# EAGLE design aloysius_B_v1 (EAGLE 9.6.2)

## Sheet 1 of 3: Power
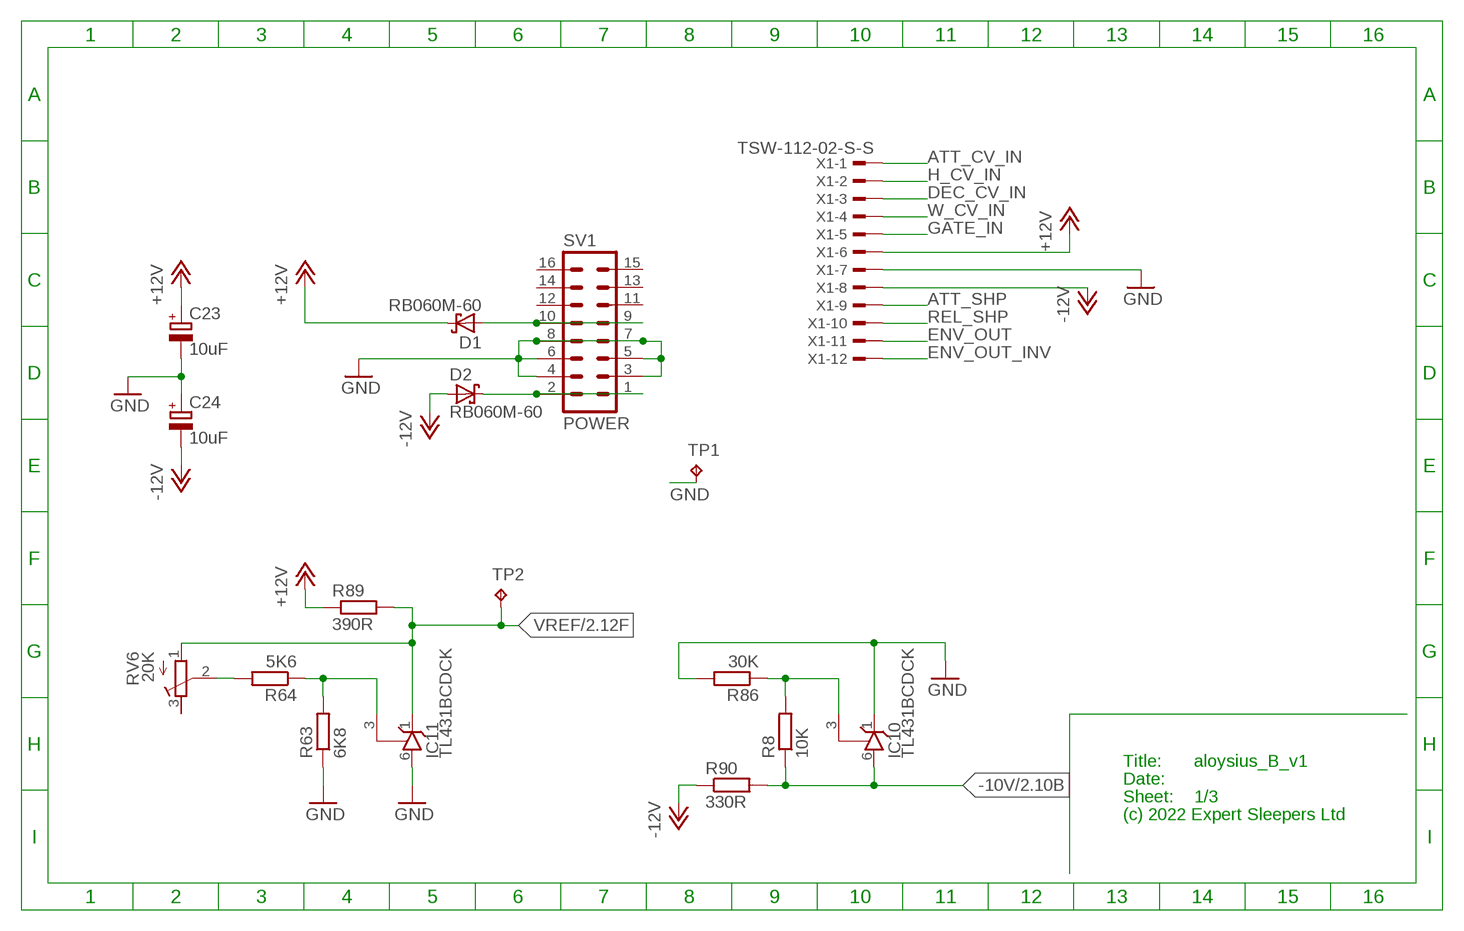
[diagram p0: schematic, sheet 1]

### Parts
C23  10uF  CPOL-EUUD-4X5,8  [UD-4X5,8_NICHICON]
C24  10uF  CPOL-EUUD-4X5,8  [UD-4X5,8_NICHICON]
D1  RB060M-60  [SOD123FL]
D2  RB060M-60  [SOD123FL]
IC10  TL431BCDCK  [DCK_SC-70]
IC11  TL431BCDCK  [DCK_SC-70]
R8  10K  R-EU_R0603  [R0603]
R63  6K8  R-EU_R0603  [R0603]
R64  5K6  R-EU_R0603  [R0603]
R86  30K  R-EU_R0603  [R0603]
R89  390R  R-EU_R1206  [R1206]
R90  330R  R-EU_R1206  [R1206]
RV6  20K  TC33X  [TC33X]
SV1  POWER  ML16  [ML16]
TP1  RA2  TPPAD1-13  [P1-13]
TP2  RA2  TPPAD1-13  [P1-13]
X1  TSW-112-02-S-S  [TSW-112-02-S-S]

### Nets
+12V: C23.+ D1.C R89.1 X1.6 ; also sheet 2,3
-10V [power]: IC10.6(A) R8.1 R90.2 ; also sheet 2
-12V: C24.- D2.A R90.1 X1.8 ; also sheet 2
ATT_CV_IN: X1.1 ; also sheet 2
ATT_SHP: X1.9 ; also sheet 2
DEC_CV_IN: X1.3 ; also sheet 2
ENV_OUT: X1.11 ; also sheet 2
ENV_OUT_INV: X1.12 ; also sheet 2
GATE_IN: X1.5 ; also sheet 3
GND [power]: C23.- C24.+ IC10.1(C) IC11.6(A) R63.1 R86.2 SV1.3 SV1.4 SV1.5 SV1.6 SV1.7 SV1.8 TP1.TP X1.7 ; also sheet 2,3
H_CV_IN: X1.2 ; also sheet 2
N$1: D2.C SV1.1 SV1.2
N$15: D1.A SV1.9 SV1.10
N$20: IC11.3(R) R63.2 R64.1
N$21: R64.2 RV6.2(S)
N$28 [power]: IC10.3(R) R8.2 R86.1
REL_SHP: X1.10 ; also sheet 2
VREF: IC11.1(C) R89.2 RV6.1(A) TP2.TP ; also sheet 2
W_CV_IN: X1.4 ; also sheet 2
Unconnected: RV6.3(E) SV1.11 SV1.12 SV1.13 SV1.14 SV1.15 SV1.16

### Notes on the sheet
- Title:
- Date:
- Sheet:
- (c) 2022 Expert Sleepers Ltd

## Sheet 2 of 3: CV processing and integrator
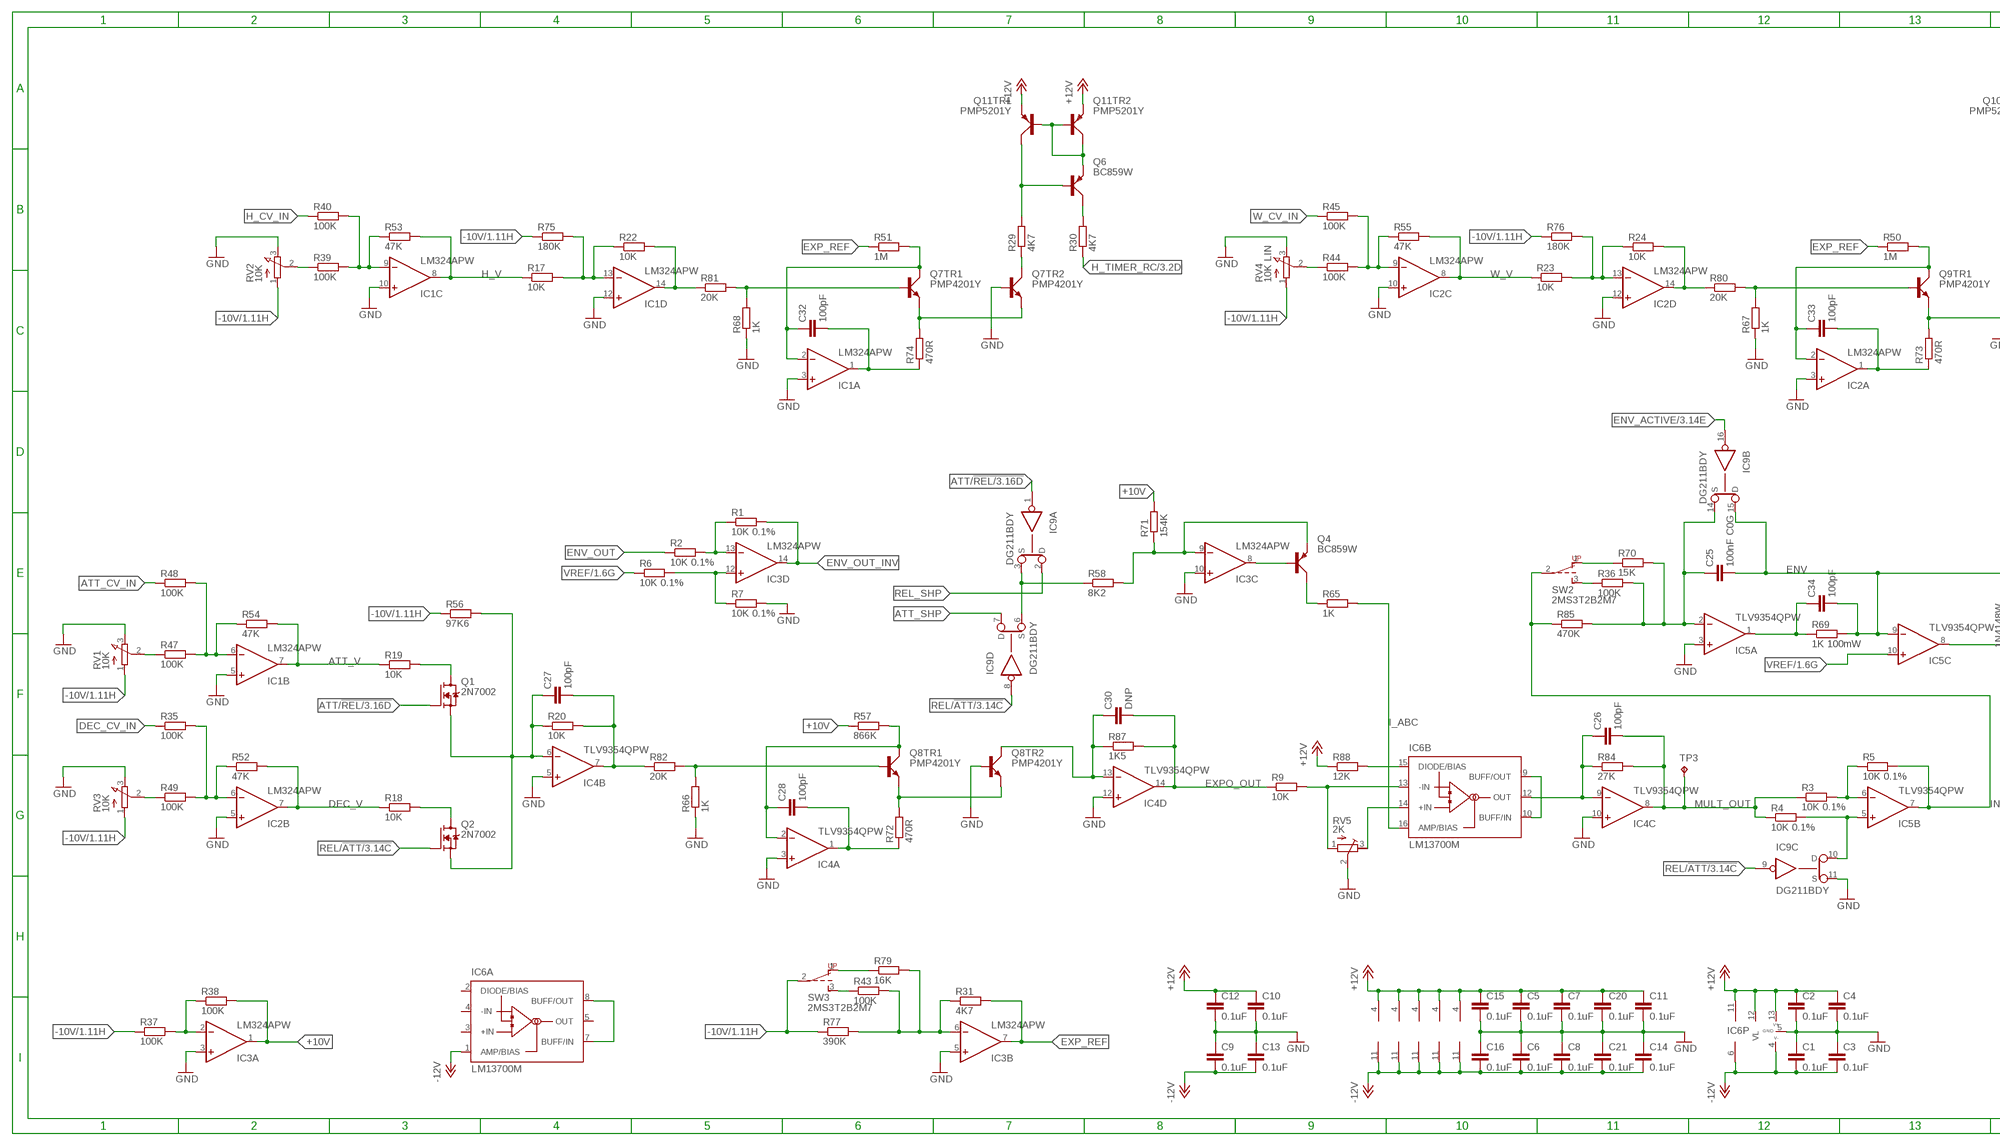
[diagram p1: schematic, sheet 2, part 1 of 2]
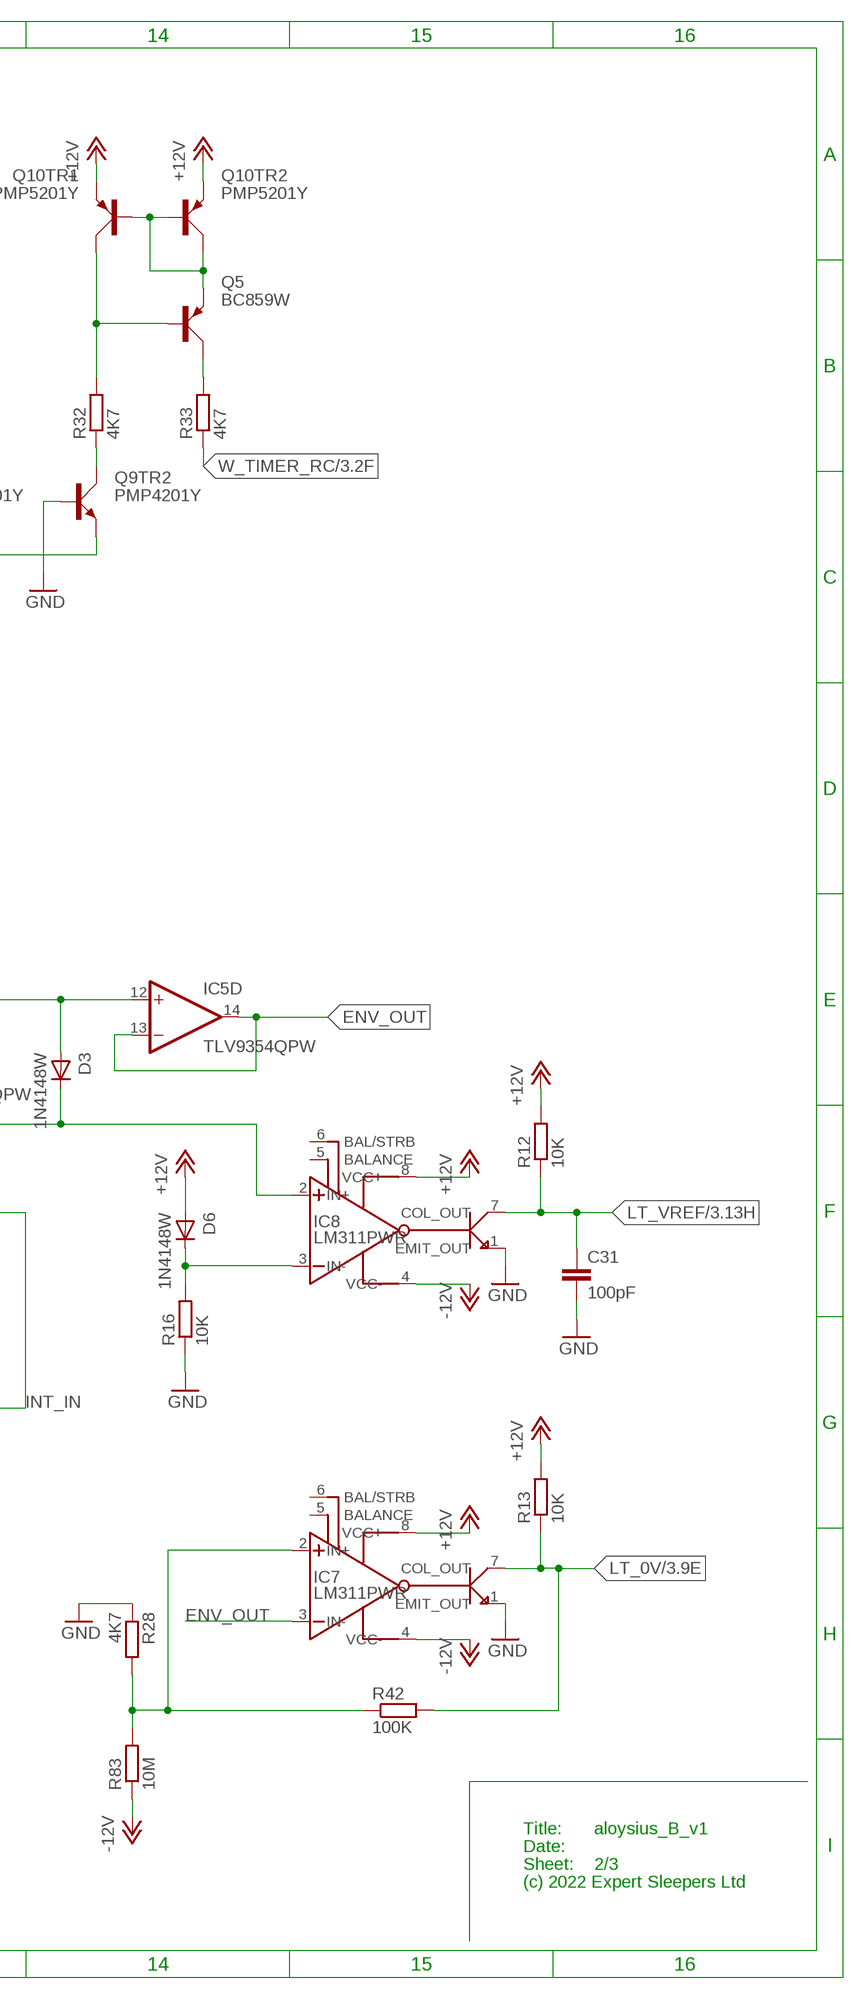
[diagram p2: schematic, sheet 2, part 2 of 2]

### Parts
C1  0.1uF  C-EUC0402  [C0402]
C2  0.1uF  C-EUC0402  [C0402]
C3  0.1uF  C-EUC0402  [C0402]
C4  0.1uF  C-EUC0402  [C0402]
C5  0.1uF  C-EUC0402  [C0402]
C6  0.1uF  C-EUC0402  [C0402]
C7  0.1uF  C-EUC0402  [C0402]
C8  0.1uF  C-EUC0402  [C0402]
C9  0.1uF  C-EUC0402  [C0402]
C10  0.1uF  C-EUC0402  [C0402]
C11  0.1uF  C-EUC0402  [C0402]
C12  0.1uF  C-EUC0402  [C0402]
C13  0.1uF  C-EUC0402  [C0402]
C14  0.1uF  C-EUC0402  [C0402]
C15  0.1uF  C-EUC0402  [C0402]
C16  0.1uF  C-EUC0402  [C0402]
C20  0.1uF  C-EUC0402  [C0402]
C21  0.1uF  C-EUC0402  [C0402]
C25  100nF C0G  C-EUC1206  [C1206]
C26  100pF  C-EUC0603  [C0603]
C27  100pF  C-EUC0603  [C0603]
C28  100pF  C-EUC0603  [C0603]
C30  DNP  C-EUC0603  [C0603]
C31  100pF  C-EUC0603  [C0603]
C32  100pF  C-EUC0603  [C0603]
C33  100pF  C-EUC0603  [C0603]
C34  100pF  C-EUC0603  [C0603]
D3  1N4148W  [SOD123]
D6  1N4148W  [SOD123]
IC1  LM324APW  TL074PW  [PW_R-PDSO-G14]
IC2  LM324APW  TL074PW  [PW_R-PDSO-G14]
IC3  LM324APW  TL074PW  [PW_R-PDSO-G14]
IC4  TLV9354QPW  TL074PW  [PW_R-PDSO-G14]
IC5  TLV9354QPW  TL074PW  [PW_R-PDSO-G14]
IC6  LM13700M  [SO16]
IC7  LM311PWR  [SOP65P640X120-8N]
IC8  LM311PWR  [SOP65P640X120-8N]
IC9  DG211BDY  DG211CJD  [SO16]
Q1  2N7002  [SOT23]
Q2  2N7002  [SOT23]
Q4  BC859W  [SOT323]
Q5  BC859W  [SOT323]
Q6  BC859W  [SOT323]
Q7  PMP4201Y  [SOT65P210X110-6N]
Q8  PMP4201Y  [SOT65P210X110-6N]
Q9  PMP4201Y  [SOT65P210X110-6N]
Q10  PMP5201Y  [SOT65P210X110-6N]
Q11  PMP5201Y  [SOT65P210X110-6N]
R1  10K 0.1%  R-EU_R0603  [R0603]
R2  10K 0.1%  R-EU_R0603  [R0603]
R3  10K 0.1%  R-EU_R0603  [R0603]
R4  10K 0.1%  R-EU_R0603  [R0603]
R5  10K 0.1%  R-EU_R0603  [R0603]
R6  10K 0.1%  R-EU_R0603  [R0603]
R7  10K 0.1%  R-EU_R0603  [R0603]
R9  10K  R-EU_R0603  [R0603]
R12  10K  R-EU_R0603  [R0603]
R13  10K  R-EU_R0603  [R0603]
R16  10K  R-EU_R0603  [R0603]
R17  10K  R-EU_R0603  [R0603]
R18  10K  R-EU_R0603  [R0603]
R19  10K  R-EU_R0603  [R0603]
R20  10K  R-EU_R0603  [R0603]
R22  10K  R-EU_R0603  [R0603]
R23  10K  R-EU_R0603  [R0603]
R24  10K  R-EU_R0603  [R0603]
R28  4K7  R-EU_R0603  [R0603]
R29  4K7  R-EU_R0603  [R0603]
R30  4K7  R-EU_R0603  [R0603]
R31  4K7  R-EU_R0603  [R0603]
R32  4K7  R-EU_R0603  [R0603]
R33  4K7  R-EU_R0603  [R0603]
R35  100K  R-EU_R0603  [R0603]
R36  100K  R-EU_R0603  [R0603]
R37  100K  R-EU_R0603  [R0603]
R38  100K  R-EU_R0603  [R0603]
R39  100K  R-EU_R0603  [R0603]
R40  100K  R-EU_R0603  [R0603]
R42  100K  R-EU_R0603  [R0603]
R43  100K  R-EU_R0603  [R0603]
R44  100K  R-EU_R0603  [R0603]
R45  100K  R-EU_R0603  [R0603]
R47  100K  R-EU_R0603  [R0603]
R48  100K  R-EU_R0603  [R0603]
R49  100K  R-EU_R0603  [R0603]
R50  1M  R-EU_R0603  [R0603]
R51  1M  R-EU_R0603  [R0603]
R52  47K  R-EU_R0603  [R0603]
R53  47K  R-EU_R0603  [R0603]
R54  47K  R-EU_R0603  [R0603]
R55  47K  R-EU_R0603  [R0603]
R56  97K6  R-EU_R0603  [R0603]
R57  866K  R-EU_R0603  [R0603]
R58  8K2  R-EU_R0603  [R0603]
R65  1K  R-EU_R0603  [R0603]
R66  1K  R-EU_R0603  [R0603]
R67  1K  R-EU_R0603  [R0603]
R68  1K  R-EU_R0603  [R0603]
R69  1K 100mW  R-EU_R0603  [R0603]
R70  15K  R-EU_R0603  [R0603]
R71  154K  R-EU_R0603  [R0603]
R72  470R  R-EU_R0603  [R0603]
R73  470R  R-EU_R0603  [R0603]
R74  470R  R-EU_R0603  [R0603]
R75  180K  R-EU_R0603  [R0603]
R76  180K  R-EU_R0603  [R0603]
R77  390K  R-EU_R0603  [R0603]
R79  16K  R-EU_R0603  [R0603]
R80  20K  R-EU_R0603  [R0603]
R81  20K  R-EU_R0603  [R0603]
R82  20K  R-EU_R0603  [R0603]
R83  10M  R-EU_R0603  [R0603]
R84  27K  R-EU_R0603  [R0603]
R85  470K  R-EU_R0603  [R0603]
R87  1K5  R-EU_R0603  [R0603]
R88  12K  R-EU_R0603  [R0603]
RV1  10K  RD1610NOA0X  [RD1610NOA0X]
RV2  10K  RD1610NOA0X  [RD1610NOA0X]
RV3  10K  RD1610NOA0X  [RD1610NOA0X]
RV4  10K LIN  RD1610NOA0X  [RD1610NOA0X]
RV5  2K  T93YA  [RTRIM3296W]
SW2  2MS3T2B2M7  [2MS1T2B2M7RE]
SW3  2MS3T2B2M7  [2MS1T2B2M7RE]
TP3  RA2  TPPAD1-13  [P1-13]

### Nets
+10V: IC3.1(A:OUT) R38.2 R57.1 R71.2
+12V: C2.1 C4.1 C5.1 C7.1 C10.1 C11.1 C12.1 C15.1 C20.1 D6.A IC1.4(P:V+) IC2.4(P:V+) IC3.4(P:V+) IC4.4(P:V+) IC5.4(P:V+) IC6.11(P:V+) IC7.8(VCC+) IC8.8(VCC+) IC9.12(VL:VL) IC9.13(P:V+) Q10.4(TR2:E) Q10.5(TR1:E) Q11.4(TR2:E) Q11.5(TR1:E) R12.2 R13.2 R88.1 ; also sheet 1,3
-10V [power]: R37.1 R56.1 R75.1 R76.1 R77.1 RV1.1(A) RV2.1(A) RV3.1(A) RV4.1(A) SW3.2(PR) ; also sheet 1
-12V: C1.2 C3.2 C6.2 C8.2 C9.2 C13.2 C14.2 C16.2 C21.2 IC1.11(P:V-) IC2.11(P:V-) IC3.11(P:V-) IC4.11(P:V-) IC5.11(P:V-) IC6.1(A:AMP/BIAS) IC6.6(P:V-) IC7.4(VCC-) IC8.4(VCC-) IC9.4(P:V-) R83.1 ; also sheet 1
ATT/!REL: IC9.1(A:IN) Q1.1(G) ; also sheet 3
ATT_CV_IN: R48.1 ; also sheet 1
ATT_SHP: IC9.7(D:D) ; also sheet 1
ATT_V: IC1.7(B:OUT) R19.1 R54.2
DEC_CV_IN: R35.1 ; also sheet 1
DEC_V: IC2.7(B:OUT) R18.1 R52.2
ENV: C25.2 C34.2 D3.A IC5.9(C:-IN) IC5.12(D:+IN) IC9.15(B:D) R69.2
ENV_ACTIVE: IC9.16(B:IN) ; also sheet 3
ENV_OUT: IC5.13(D:-IN) IC5.14(D:OUT) IC7.3(IN-) R2.1 ; also sheet 1
ENV_OUT_INV: IC3.14(D:OUT) R1.2 ; also sheet 1
EXP_REF: IC3.7(B:OUT) R31.2 R50.1 R51.1
EXPO_OUT: C30.2 IC4.14(D:OUT) R9.1 R87.2
GND [power]: C1.1 C2.2 C3.1 C4.2 C5.2 C6.1 C7.2 C8.1 C9.1 C10.2 C11.2 C12.2 C13.1 C14.1 C15.2 C16.1 C20.2 C21.1 C31.2 IC1.3(A:+IN) IC1.5(B:+IN) IC1.10(C:+IN) IC1.12(D:+IN) IC2.3(A:+IN) IC2.5(B:+IN) IC2.10(C:+IN) IC2.12(D:+IN) IC3.3(A:+IN) IC3.5(B:+IN) IC3.10(C:+IN) IC4.3(A:+IN) IC4.5(B:+IN) IC4.10(C:+IN) IC4.12(D:+IN) IC5.3(A:+IN) IC7.1(EMIT_OUT) IC8.1(EMIT_OUT) IC9.5(P:GND) IC9.11(C:S) Q7.2(TR2:B) Q8.2(TR2:B) Q9.2(TR2:B) R7.2 R16.1 R28.1 R66.1 R67.1 R68.1 RV1.3(E) RV2.3(E) RV3.3(E) RV4.3(E) RV5.2(S) ; also sheet 1,3
H_CV_IN: R40.1 ; also sheet 1
H_TIMER_RC: R30.1 ; also sheet 3
H_V: IC1.8(C:OUT) R17.1 R53.2
I_ABC: IC6.16(B:AMP/BIAS) R65.2
INT_IN: IC5.7(B:OUT) R5.2 R85.1 SW2.2(PR)
LT_0V: IC7.7(COL_OUT) R13.1 R42.2 ; also sheet 3
LT_VREF: C31.1 IC8.7(COL_OUT) R12.1 ; also sheet 3
MULT_OUT: C26.2 IC4.8(C:OUT) R3.1 R4.1 R84.2 TP3.TP
N$2: IC3.13(D:-IN) R1.1 R2.2
N$4: C34.1 IC5.1(A:OUT) R69.1
N$5: D3.C IC5.8(C:OUT) IC8.2(IN+)
N$8: C32.1 IC1.2(A:-IN) Q7.6(TR1:C) R51.2
N$9: C30.1 IC4.13(D:-IN) Q8.3(TR2:C) R87.1
N$10: C26.1 IC4.9(C:-IN) IC6.12(B:OUT) R84.1
N$12: IC6.15(B:DIODE/BIAS) R88.2
N$13: IC5.6(B:-IN) R3.2 R5.1
N$14: IC6.13(B:-IN) R9.2 RV5.1(A)
N$16: IC6.7(A:BUFF/IN) IC6.8(A:BUFF/OUT)
N$19: C32.2 IC1.1(A:OUT) R74.1
N$23: D6.C IC8.3(IN-) R16.2
N$24: Q7.4(TR2:E) Q7.5(TR1:E) R74.2
N$25: IC1.14(D:OUT) R22.2 R81.1
N$26: R39.1 RV2.2(S)
N$29: Q7.1(TR1:B) R68.2 R81.2
N$30: Q6.3(C) R30.2
N$31: R79.1 SW3.1(RU)
N$32: IC1.9(C:-IN) R39.2 R40.2 R53.1
N$33: Q1.3(D) R19.2
N$34: C27.2 IC4.7(B:OUT) R20.2 R82.1
N$35: Q6.1(B) Q11.6(TR1:C) R29.2
N$36: Q6.2(E) Q11.1(TR1:B) Q11.2(TR2:B) Q11.3(TR2:C)
N$37: R43.1 SW3.3(RD)
N$41: IC3.12(D:+IN) R6.2 R7.1
N$42: Q7.3(TR2:C) R29.1
N$43: IC7.2(IN+) R28.2 R42.1 R83.2
N$44: IC3.6(B:-IN) R31.1 R43.2 R77.2 R79.2
N$45: C25.1 IC5.2(A:-IN) IC9.14(B:S) R36.2 R70.2 R85.2
N$46: IC3.8(C:OUT) Q4.1(B)
N$47: R44.1 RV4.2(S)
N$48: IC5.5(B:+IN) IC9.10(C:D) R4.2
N$49: R47.1 RV1.2(S)
N$50: Q2.3(D) R18.2
N$51: IC2.9(C:-IN) R44.2 R45.2 R55.1
N$52: IC1.13(D:-IN) R17.2 R22.1 R75.2
N$53: C27.1 IC4.6(B:-IN) Q1.2(S) Q2.2(S) R20.1 R56.2
N$54: Q8.1(TR1:B) R66.2 R82.2
N$55: IC6.14(B:+IN) RV5.3(E)
N$56: IC1.6(B:-IN) R47.2 R48.2 R54.1
N$57: R49.1 RV3.2(S)
N$58: IC2.6(B:-IN) R35.2 R49.2 R52.1
N$59: R36.1 SW2.3(RD)
N$60: C28.1 IC4.2(A:-IN) Q8.6(TR1:C) R57.2
N$61: C28.2 IC4.1(A:OUT) R72.1
N$62: IC3.9(C:-IN) Q4.2(E) R58.2 R71.1
N$63: R70.1 SW2.1(RU)
N$64: Q8.4(TR2:E) Q8.5(TR1:E) R72.2
N$65: IC2.13(D:-IN) R23.2 R24.1 R76.2
N$66: C33.1 IC2.2(A:-IN) Q9.6(TR1:C) R50.2
N$69: IC3.2(A:-IN) R37.2 R38.1
N$70: C33.2 IC2.1(A:OUT) R73.1
N$71: Q9.4(TR2:E) Q9.5(TR1:E) R73.2
N$72: IC2.14(D:OUT) R24.2 R80.1
N$76: Q9.1(TR1:B) R67.2 R80.2
N$79: Q4.3(C) R65.1
N$80: IC9.3(A:S) IC9.6(D:S) R58.1
N$81: Q5.3(C) R33.2
N$82: Q5.1(B) Q10.6(TR1:C) R32.2
N$83: IC6.9(B:BUFF/OUT) IC6.10(B:BUFF/IN)
N$84: Q5.2(E) Q10.1(TR1:B) Q10.2(TR2:B) Q10.3(TR2:C)
N$85: Q9.3(TR2:C) R32.1
REL/!ATT: IC9.8(D:IN) IC9.9(C:IN) Q2.1(G) ; also sheet 3
REL_SHP: IC9.2(A:D) ; also sheet 1
VREF: IC5.10(C:+IN) R6.1 ; also sheet 1
W_CV_IN: R45.1 ; also sheet 1
W_TIMER_RC: R33.1 ; also sheet 3
W_V: IC2.8(C:OUT) R23.1 R55.2
Unconnected: IC6.2(A:DIODE/BIAS) IC6.3(A:+IN) IC6.4(A:-IN) IC6.5(A:OUT) IC7.5(BALANCE) IC7.6(BAL/STRB) IC8.5(BALANCE) IC8.6(BAL/STRB)

### Notes on the sheet
- Title:
- Date:
- Sheet:
- (c) 2022 Expert Sleepers Ltd

## Sheet 3 of 3: Logic
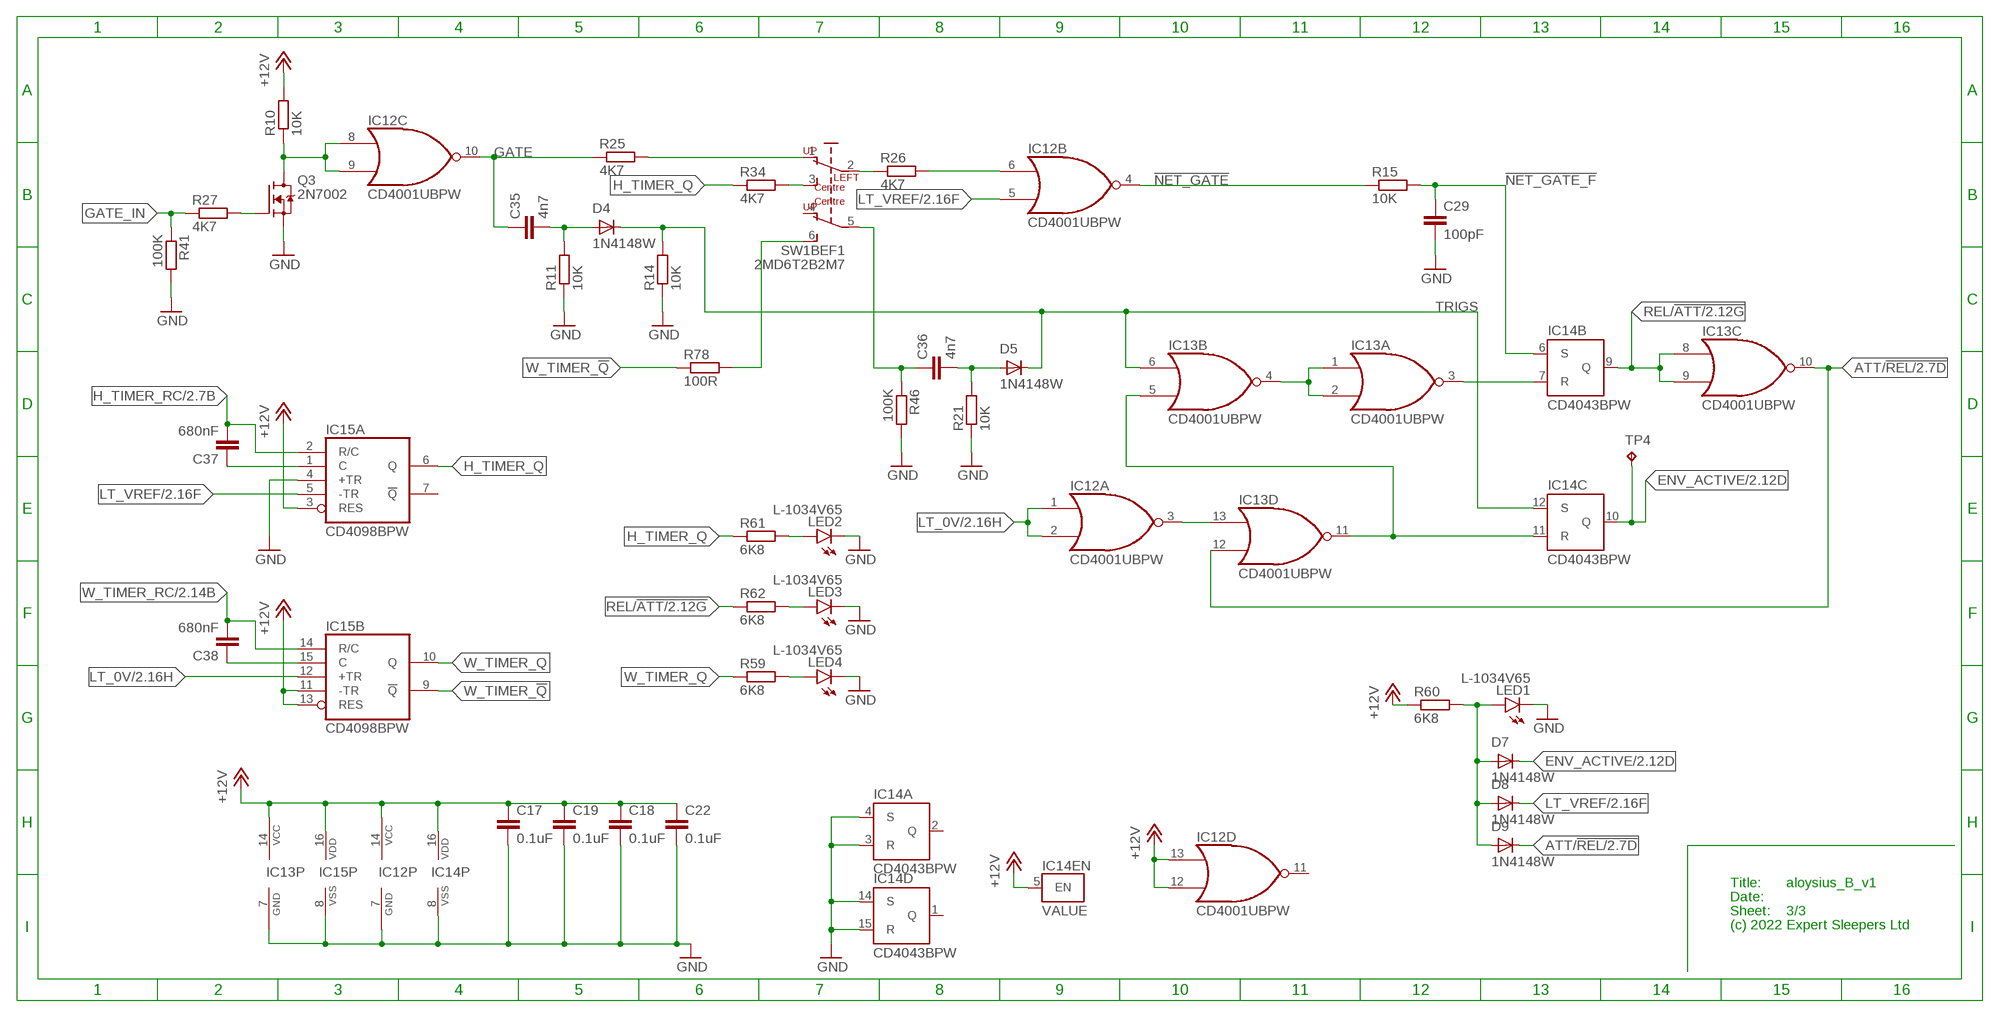
[diagram p3: schematic, sheet 3]

### Parts
C17  0.1uF  C-EUC0402  [C0402]
C18  0.1uF  C-EUC0402  [C0402]
C19  0.1uF  C-EUC0402  [C0402]
C22  0.1uF  C-EUC0402  [C0402]
C29  100pF  C-EUC0603  [C0603]
C35  4n7  C-EUC0603  [C0603]
C36  4n7  C-EUC0603  [C0603]
C37  680nF  C-EUC0603  [C0603]
C38  680nF  C-EUC0603  [C0603]
D4  1N4148W  [SOD123]
D5  1N4148W  [SOD123]
D7  1N4148W  [SOD123]
D8  1N4148W  [SOD123]
D9  1N4148W  [SOD123]
IC12  CD4001UBPW  [TSSOP14]
IC13  CD4001UBPW  [TSSOP14]
IC14  CD4043BPW  [TSSOP16]
IC15  CD4098BPW  [TSSOP16]
LED1  L-1034V65  [L-1034_V6.5MM]
LED2  L-1034V65  [L-1034_V6.5MM]
LED3  L-1034V65  [L-1034_V6.5MM]
LED4  L-1034V65  [L-1034_V6.5MM]
Q3  2N7002  [SOT23]
R10  10K  R-EU_R0603  [R0603]
R11  10K  R-EU_R0603  [R0603]
R14  10K  R-EU_R0603  [R0603]
R15  10K  R-EU_R0603  [R0603]
R21  10K  R-EU_R0603  [R0603]
R25  4K7  R-EU_R0603  [R0603]
R26  4K7  R-EU_R0603  [R0603]
R27  4K7  R-EU_R0603  [R0603]
R34  4K7  R-EU_R0603  [R0603]
R41  100K  R-EU_R0603  [R0603]
R46  100K  R-EU_R0603  [R0603]
R59  6K8  R-EU_R0603  [R0603]
R60  6K8  R-EU_R0603  [R0603]
R61  6K8  R-EU_R0603  [R0603]
R62  6K8  R-EU_R0603  [R0603]
R78  100R  R-EU_R0603  [R0603]
SW1  2MD6T2B2M7  [2MD1T2B2M7RE]
TP4  RA2  TPPAD1-13  [P1-13]

### Nets
!NET_GATE: IC12.4(B:O) R15.1
!NET_GATE_F: C29.1 IC14.6(B:S) R15.2
+12V: C17.1 C18.1 C19.1 C22.1 IC12.12(D:I1) IC12.13(D:I0) IC12.14(P:VCC) IC13.14(P:VCC) IC14.5(EN:EN) IC14.16(P:VDD) IC15.3(A:RES) IC15.11(B:-TR) IC15.13(B:RES) IC15.16(P:VDD) R10.2 R60.1 ; also sheet 1,2
ATT/!REL: D9.C IC13.10(C:O) IC13.12(D:I1) ; also sheet 2
ENV_ACTIVE: D7.C IC14.10(C:Q) TP4.TP ; also sheet 2
GATE: C35.1 IC12.10(C:O) R25.1
GATE_IN: R27.1 R41.1 ; also sheet 1
GATE_SW: R25.2 SW1.1(BEF1:LU)
GND [power]: C17.2 C18.2 C19.2 C22.2 C29.2 IC12.7(P:GND) IC13.7(P:GND) IC14.3(A:R) IC14.4(A:S) IC14.8(P:VSS) IC14.14(D:S) IC14.15(D:R) IC15.4(A:+TR) IC15.8(P:VSS) LED1.K(C) LED2.K(C) LED3.K(C) LED4.K(C) Q3.2(S) R11.1 R14.1 R21.1 R41.2 R46.2 ; also sheet 1,2
H_TIMER_Q: IC15.6(A:Q) R34.1 R61.1
H_TIMER_RC: C37.2 IC15.2(A:R/C) ; also sheet 2
LT_0V: IC12.1(A:I0) IC12.2(A:I1) IC15.12(B:+TR) ; also sheet 2
LT_VREF: D8.C IC12.5(B:I1) IC15.5(A:-TR) ; also sheet 2
N$3: R34.2 SW1.3(BEF1:LD)
N$6: C36.2 D5.A R21.2
N$11: C37.1 IC15.1(A:C)
N$17: IC12.6(B:I0) R26.2
N$18: IC12.3(A:O) IC13.13(D:I0)
N$22: C38.1 IC15.15(B:C)
N$27: LED4.A R59.2
N$38: C35.2 D4.A R11.2
N$39: IC12.8(C:I0) IC12.9(C:I1) Q3.3(D) R10.1
N$40: Q3.1(G) R27.2
N$67: R26.1 SW1.2(BEF1:PL)
N$73: IC13.3(A:O) IC14.7(B:R)
N$75: LED2.A R61.2
N$77: IC13.5(B:I1) IC13.11(D:O) IC14.11(C:R)
N$78: LED3.A R62.2
N$86: IC13.1(A:I0) IC13.2(A:I1) IC13.4(B:O)
N$88: D7.A D8.A D9.A LED1.A R60.2
REL/!ATT: IC13.8(C:I0) IC13.9(C:I1) IC14.9(B:Q) R62.1 ; also sheet 2
RETRIG: R78.2 SW1.6(BEF1:RD)
RETRIG_SW: C36.1 R46.1 SW1.5(BEF1:PR)
TRIGS: D4.C D5.C IC13.6(B:I0) IC14.12(C:S) R14.2
W_TIMER_!Q: IC15.9(B:!Q) R78.1
W_TIMER_Q: IC15.10(B:Q) R59.1
W_TIMER_RC: C38.2 IC15.14(B:R/C) ; also sheet 2
Unconnected: IC12.11(D:O) IC14.1(D:Q) IC14.2(A:Q) IC15.7(A:!Q) SW1.4(BEF1:RU)

### Notes on the sheet
- Title:
- Date:
- Sheet:
- (c) 2022 Expert Sleepers Ltd

## Library data of the parts
C1-C22 C25-C38 = rcl:C-EU: CAPACITOR, European symbol
C23 C24 = rcl:CPOL-EU: POLARIZED CAPACITOR, European symbol
D1 D2 = rohm2:RB060M-60: Schottky Barrier Diode
D3-D9 = diodes:1N4148W
IC1-IC5 = digital-audio:TL074: OP AMP
IC6 = texas:LM13700: Dual Operational Transconductance Amplifiers with Linearizing Diodes and Buffers Source: lm13700.PDF
IC7 IC8 = SamacSys_Parts:LM311PWR: High Speed, 30V, Differential Comparator With Strobes Source: Datasheet <http://www.ti.com/lit/ds/symlink/lm311.pdf>; ARROW_PART_NUMBER: LM311PWR; ARROW_PRICE-STOCK: https://www.arrow.com/en/products/lm311pwr/texas-instruments; DESCRIPTION: High Speed, 30V, Differential Comparator With Strobes; HEIGHT: 1.2mm; MANUFACTURER_NAME: Texas Instruments; MANUFACTURER_PART_NUMBER: LM311PWR; MOUSER_PART_NUMBER: 595-LM311PWR; MOUSER_PRICE-STOCK: https://www.mouser.co.uk/ProductDetail/Texas-Instruments/LM311PWR/?qs=YEaxc5757jOQ2Epklu87Vw%3D%3D
IC9 = linear:DG211CJ: CMOS SWITCH
IC10 IC11 = texas:TL431*
IC12 IC13 = logic:CD4001UB: Quad 2-input NOR gate
IC14 = logic:CD4043B: Quad 3-state NOR R/S LATCH
IC15 = logic:CD4098B: Dual monostable MULTIVIBRATOR Source: Texas Instruments (Data sheet acquired frm Harris Semiconductor SCHS065) http://pdf1.alldatasheet.com/datasheet-pdf/view/26897/TI/CD4098.html
LED1-LED4 = leds:L-1034
Q1-Q3 = digital-audio:2N7002: 2N7002 N-channel MOSFET
Q4-Q6 = NXP:BC859W
Q7-Q9 = SamacSys_Parts:PMP4201Y: Bipolar Transistors - BJT MATCHED PAIR Source: Datasheet <https://componentsearchengine.com/Datasheets/1/PMP4201Y,135.pdf>; ARROW_PART_NUMBER: PMP4201Y,135; ARROW_PRICE-STOCK: https://www.arrow.com/en/products/pmp4201y135/nexperia; DESCRIPTION: Bipolar Transistors - BJT MATCHED PAIR; HEIGHT: 1.1mm; MANUFACTURER_NAME: Nexperia; MANUFACTURER_PART_NUMBER: PMP4201Y,135; MOUSER_PART_NUMBER: 771-PMP4201Y135; MOUSER_PRICE-STOCK: https://www.mouser.co.uk/ProductDetail/Nexperia/PMP4201Y135?qs=LOCUfHb8d9uqwNS3d98RHQ%3D%3D
Q10 Q11 = SamacSys_Parts:PMP5201Y: Bipolar Transistors - BJT MATCHED PAIR Source: Datasheet <https://eu.mouser.com/datasheet/2/268/40001414E-1066494.pdf>; ARROW_PART_NUMBER: PMP5201Y,135; ARROW_PRICE-STOCK: https://www.arrow.com/en/products/pmp5201y135/nexperia; DESCRIPTION: Bipolar Transistors - BJT MATCHED PAIR; HEIGHT: 1.1mm; MANUFACTURER_NAME: Nexperia; MANUFACTURER_PART_NUMBER: PMP5201Y,135; MOUSER_PART_NUMBER: 771-PMP5201Y135; MOUSER_PRICE-STOCK: https://www.mouser.co.uk/ProductDetail/Nexperia/PMP5201Y135?qs=LOCUfHb8d9vvvsx1DGNhtA%3D%3D
R1-R90 = rcl:R-EU_: RESISTOR, European symbol
RV1-RV4 = soundwell:RD1610NOA0X: 16mm Potentiometer one level Source: http://www.alphapotentiometers.net/html/16mm_pot_2.html
RV5 = vishay:T93YA
RV6 = bourns:TC33X
SV1 = digital-audio:ML16: MULTICOMP - MC9A12-1634
SW1 = switch-multicomp:2MD6*: TINY SWITCH ON - ON Source: http://www2.produktinfo.conrad.com/datenblaetter/700000-724999/705152-da-01-de-Subminiaturschalter_TL_36WO.pdf
SW2 SW3 = switch-multicomp:2MS3*M7
TP1-TP4 = testpad:TP: Test pad
X1 = con-samtec:TSW-112-02-S-S: THROUGH-HOLE .025" SQ POST HEADER Source: Samtec TSW.pdf; OC_FARNELL: unknown; OC_NEWARK: unknown

## Net classes
0 default: width 0.203 mm

## Board
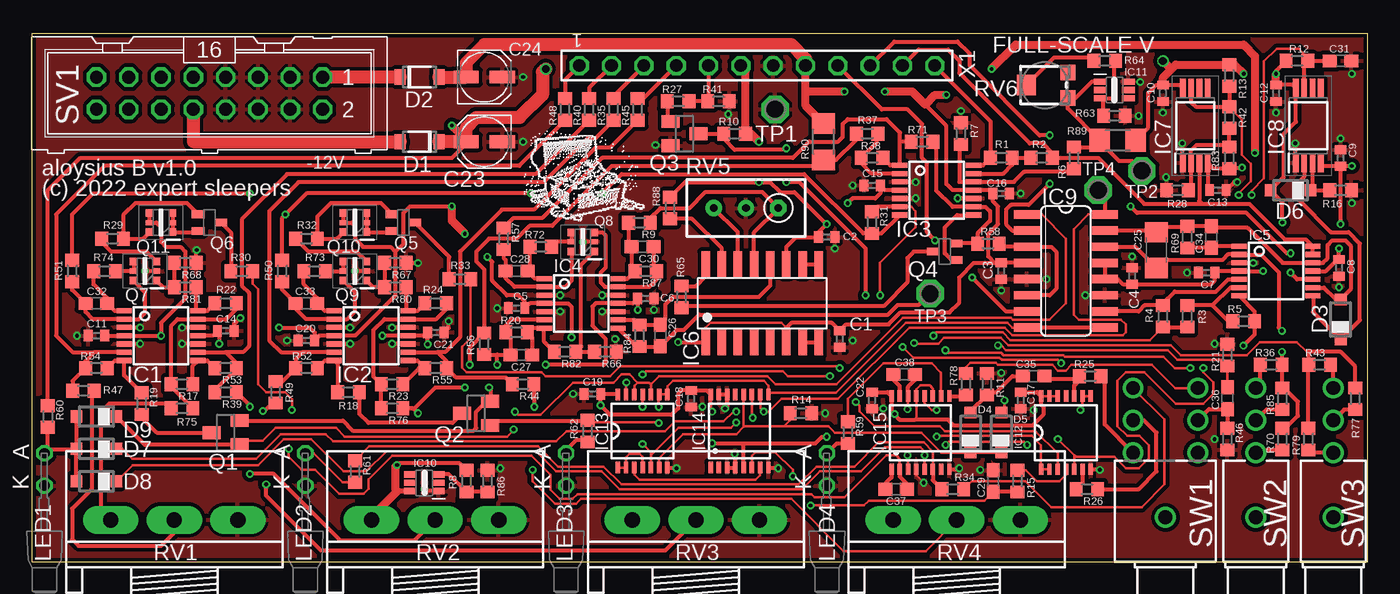
[diagram p4: board, top side]
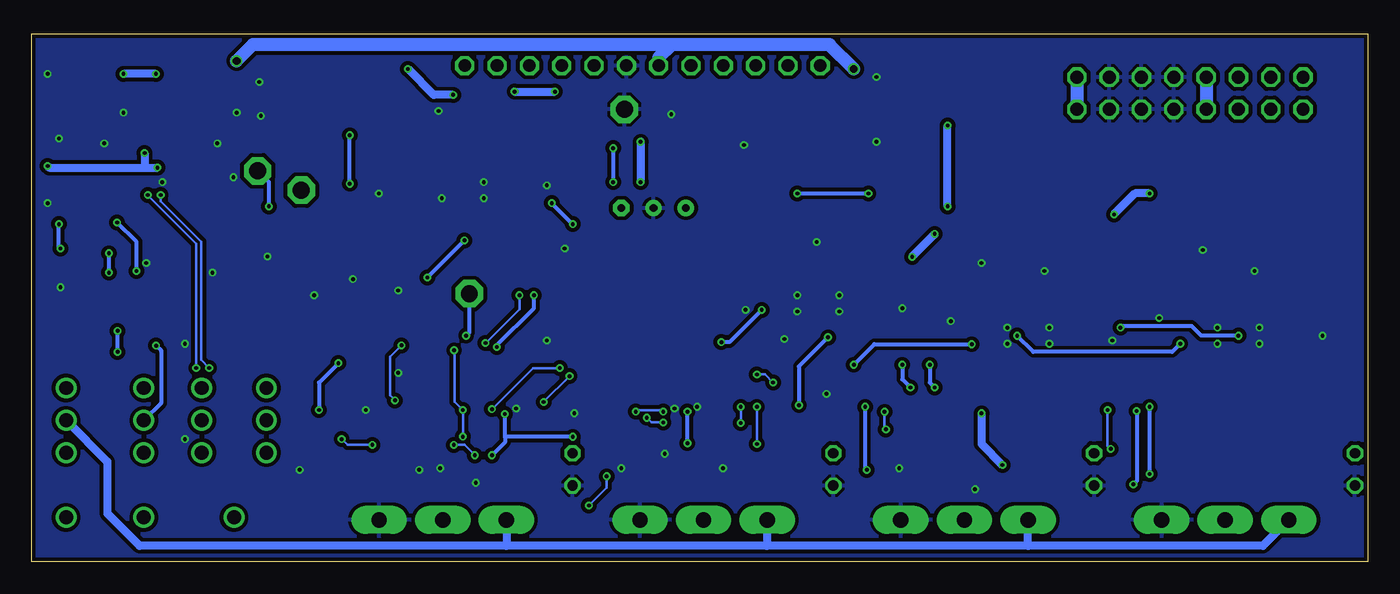
[diagram p5: board, bottom side, seen from below]

Size 105 x 41.5 mm. Coordinates in mm from the lower left corner, seen from the top.
Outline: 0,0 105,0 105,41.5 0,41.5 0,0
Copper layers (1*16): Top 0.035mm / dielectric 1.5mm / Bottom 0.035mm
Design rules "pcbtrain *": minimum track width 0.125mm, minimum drill 0.3mm, track to track 0.125mm, track to pad 0.125mm, pad to pad 0.125mm, via to via 0.125mm, smd to smd 0.125mm, copper to edge 0.25mm, drill to drill 8mil, minimum pad ring 0.15mm, minimum via ring 0.15mm, stop-mask expansion 4mil, vias tented up to drill 0mil, thermal gap 10mil

### Footprints (pad centres in the part's own frame; a part is rotated, then mirrored left to right if it is on the bottom)
C0402 = smd 0.7 x 0.9: 1 -0.65,0; 2 0.65,0
UD-4X5,8_NICHICON = smd 2 x 1: + 1.425,0; - -1.425,0
C1206 = smd 1.6 x 1.8: 1 -1.4,0; 2 1.4,0
C0603 = smd 1.1 x 1: 1 -0.85,0; 2 0.85,0
SOD123FL = smd 0.85 x 1.2: A 1.525,0; C -1.525,0
SOD123 = smd 0.9 x 0.95: A 1.575,0; C -1.575,0
PW_R-PDSO-G14 = smd 0.4 x 1.2: 1 -1.95,-2.9; 2 -1.3,-2.9; 3 -0.65,-2.9; 4 0,-2.9; 5 0.65,-2.9; 6 1.3,-2.9; 7 1.95,-2.9; 8 1.95,2.9; 9 1.3,2.9; 10 0.65,2.9; 11 0,2.9; 12 -0.65,2.9; 13 -1.3,2.9; 14 -1.95,2.9
SO16 = smd 0.66 x 2.032: 1 -4.445,-3.073; 2 -3.175,-3.073; 3 -1.905,-3.073; 4 -0.635,-3.073; 5 0.635,-3.073; 6 1.905,-3.073; 7 3.175,-3.073; 8 4.445,-3.073; 9 4.445,3.073; 10 3.175,3.073; 11 1.905,3.073; 12 0.635,3.073; 13 -0.635,3.073; 14 -1.905,3.073; 15 -3.175,3.073; 16 -4.445,3.073
SOP65P640X120-8N = smd 1.475 x 0.45: 1 -2.938,0.975; 2 -2.938,0.325; 3 -2.938,-0.325; 4 -2.938,-0.975; 5 2.938,-0.975; 6 2.938,-0.325; 7 2.938,0.325; 8 2.938,0.975
DCK_SC-70 = smd 1 x 0.5: 1 -1.1,0.65; 2 -1.1,0; 3 -1.1,-0.65; 4 1.1,-0.65; 5 1.1,0; 6 1.1,0.65
TSSOP14 = smd 0.9 x 0.35: 1 -2.875,1.95; 2 -2.875,1.3; 3 -2.875,0.65; 4 -2.875,0; 5 -2.875,-0.65; 6 -2.875,-1.3; 7 -2.875,-1.95; 8 2.875,-1.95; 9 2.875,-1.3; 10 2.875,-0.65; 11 2.875,0; 12 2.875,0.65; 13 2.875,1.3; 14 2.875,1.95
TSSOP16 = smd 0.9 x 0.35: 1 -2.875,2.275; 2 -2.875,1.625; 3 -2.875,0.975; 4 -2.875,0.325; 5 -2.875,-0.325; 6 -2.875,-0.975; 7 -2.875,-1.625; 8 -2.875,-2.275; 9 2.875,-2.275; 10 2.875,-1.625; 11 2.875,-0.975; 12 2.875,-0.325; 13 2.875,0.325; 14 2.875,0.975; 15 2.875,1.625; 16 2.875,2.275
L-1034_V6.5MM = drill 0.813 pad 1.27 octagon: A 9.04,0; K 6.5,0
SOT23 = smd 1 x 1.4: 1 -0.95,-1.1; 2 0.95,-1.1; 3 0,1.1
SOT323 = smd 0.6 x 1: 1 -0.65,-0.9; 2 0.65,-0.9; 3 0,0.9
SOT65P210X110-6N = smd 0.6 x 0.6: 1 -0.9,0.75; 3 -0.9,-0.75; 4 0.9,-0.75; 6 0.9,0.75 | smd 0.6 x 0.4: 2 -0.9,0; 5 0.9,0
R0603 = smd 1 x 1.1: 1 -0.85,0; 2 0.85,0
R1206 = smd 1.6 x 1.803: 1 -1.422,0; 2 1.422,0
RD1610NOA0X = drill 1.2 pad 2.184 long: 1 -5,3.8; 2 0,3.8; 3 5,3.8
RTRIM3296W = drill 0.61 pad 1.27 octagon: 1 0,-2.54 | drill 0.61 pad 1.27: 2 0,0; 3 0,2.54
TC33X = smd 1.2 x 1.2: 1 -1,-1.8; 3 1,-1.8 | smd 1.6 x 1.5: 2 0,1.45
ML16 = drill 1.016 octagon: 1 -8.89,-1.27; 2 -8.89,1.27; 3 -6.35,-1.27; 4 -6.35,1.27; 5 -3.81,-1.27; 6 -3.81,1.27; 7 -1.27,-1.27; 8 -1.27,1.27; 9 1.27,-1.27; 10 1.27,1.27; 11 3.81,-1.27; 12 3.81,1.27; 13 6.35,-1.27; 14 6.35,1.27; 15 8.89,-1.27; 16 8.89,1.27
2MD1T2B2M7RE = drill 1.092: 1 -2.54,5.08; 2 -2.54,7.62; 3 -2.54,10.16; 4 2.54,5.08; 5 2.54,7.62; 6 2.54,10.16; 7 0,0
2MS1T2B2M7RE = drill 1.092: 1 0,5.08; 2 0,7.62; 3 0,10.16; 7 0,0
P1-13 = drill 1.321 pad 2.159 octagon: TP 0,0
TSW-112-02-S-S = drill 1 pad 1.5 octagon: 1 13.97,0; 2 11.43,0; 3 8.89,0; 4 6.35,0; 5 3.81,0; 6 1.27,0; 7 -1.27,0; 8 -3.81,0; 9 -6.35,0; 10 -8.89,0; 11 -11.43,0; 12 -13.97,0

### Placement (x,y rotation side)
C1  63.5,17.53 90 top
C2  62.48,25.53 0 top
C3  76.2,22.86 90 top
C4  86.49,22.48 90 top
C5  38.1,19.94 180 top
C6  48.26,20.7 180 top
C7  92.33,22.73 180 top
C8  102.74,23.11 90 top
C9  102.87,31.75 270 top
C10  88.9,36.83 270 top
C11  5.08,17.78 180 top
C12  97.79,36.83 270 top
C13  93.22,29.21 180 top
C14  15.24,18.16 180 top
C15  66.04,29.59 180 top
C16  76.2,28.96 180 top
C17  77.72,12.7 270 top
C18  51.82,12.83 270 top
C19  44.07,13.21 180 top
C20  21.59,17.4 180 top
C21  31.75,18.03 180 top
C22  66.04,12.7 270 top
C23  35.56,33.02 180 top
C24  35.56,38.1 0 top
C25  88.39,24.51 90 top
C26  49.4,17.8 270 top
C27  38.48,16.26 0 top
C28  38.1,22.86 0 top
C29  75.56,6.35 90 top
C30  48.01,24.77 180 top
C31  102.87,39.37 0 top
C32  5.08,20.32 0 top
C33  21.59,20.32 0 top
C34  92.71,25.53 90 top
C35  78.74,14.61 180 top
C36  93.98,12.87 90 top
C37  67.94,5.71 0 top
C38  68.58,14.73 0 top
D1  30.48,33.02 180 top
D2  30.48,38.1 0 top
D3  102.87,19.05 90 top
D4  73.79,10.16 90 top
D5  76.2,10.16 90 top
D6  98.93,29.21 180 top
D7  5.08,8.89 180 top
D8  5.08,6.35 180 top
D9  5.08,11.43 180 top
IC1  10.16,17.78 270 top
IC2  26.67,17.78 270 top
IC3  71.12,29.21 270 top
IC4  43.18,20.32 270 top
IC5  97.79,22.86 270 top
IC6  57.4,20.32 0 top
IC7  91.44,34.29 90 top
IC8  100.33,34.29 90 top
IC9  81.28,22.86 270 top
IC10  30.86,6.22 180 top
IC11  85.09,37.08 0 top
IC12  81.28,10.16 90 top
IC13  48.01,10.29 90 top
IC14  55.63,10.29 90 top
IC15  69.85,10.16 90 top
LED1  1,-0.5 90 top
LED2  21.5,-0.5 90 top
LED3  42,-0.5 90 top
LED4  62.5,-0.5 90 top
Q1  15.24,10.16 90 top
Q2  34.92,11.68 90 top
Q3  51.31,33.66 270 top
Q4  71.75,24.38 90 top
Q5  29.21,26.67 270 top
Q6  13.97,26.67 270 top
Q7  8.89,22.86 180 top
Q8  43.31,25.15 180 top
Q9  25.4,22.86 180 top
Q10  25.4,26.67 180 top
Q11  10.16,26.67 180 top
R1  76.2,31.75 180 top
R2  79.38,31.75 180 top
R3  90.81,19.3 90 top
R4  88.9,19.3 90 top
R5  95.25,18.92 0 top
R6  81.92,31.75 270 top
R7  73.03,33.66 90 top
R8  34.16,6.35 270 top
R9  47.75,26.67 0 top
R10  55.24,33.66 0 top
R11  75.06,13.97 270 top
R12  99.44,39.37 180 top
R13  94.11,38.23 90 top
R14  60.45,11.68 180 top
R15  77.47,6.35 270 top
R16  102.87,29.21 180 top
R17  11.81,13.97 180 top
R18  24.89,13.34 0 top
R19  8.64,12.45 270 top
R20  38.1,18.03 0 top
R21  93.98,16.26 270 top
R22  15.24,20.32 180 top
R23  28.32,13.97 180 top
R24  31.75,20.32 180 top
R25  83.19,14.61 0 top
R26  82.93,5.71 180 top
R27  50.8,36.2 180 top
R28  90.04,29.21 0 top
R29  6.35,25.4 0 top
R30  16.51,22.86 180 top
R31  66.04,26.67 270 top
R32  21.59,25.4 0 top
R33  33.66,22.23 180 top
R34  72.39,5.71 0 top
R35  45.72,35.56 270 top
R36  97.41,15.49 0 top
R37  65.66,33.66 0 top
R38  66.04,31.75 0 top
R39  15.24,13.34 180 top
R40  43.81,35.56 270 top
R41  53.98,36.2 0 top
R42  94.11,34.92 90 top
R43  101.22,15.49 180 top
R44  38.61,13.97 180 top
R45  47.62,35.56 270 top
R46  93.98,9.65 270 top
R47  4.06,13.46 180 top
R48  41.91,35.56 270 top
R49  19.18,13.34 90 top
R50  19.68,22.86 270 top
R51  3.17,22.86 270 top
R52  21.59,15.24 0 top
R53  15.24,15.24 180 top
R54  5.08,15.24 0 top
R55  31.75,15.24 180 top
R56  35.56,17.14 270 top
R57  37.08,25.4 270 top
R58  75.18,25.02 180 top
R59  64.14,10.16 270 top
R60  1.27,11.43 270 top
R61  25.4,7.11 270 top
R62  43.69,10.29 270 top
R63  85.09,35.05 180 top
R64  84.33,39.37 180 top
R65  51.05,20.83 90 top
R66  45.09,16.51 180 top
R67  28.57,23.5 180 top
R68  12.06,23.5 180 top
R69  90.81,25.53 90 top
R70  98.3,9.65 90 top
R71  69.98,33.02 180 top
R72  40.01,24.77 0 top
R73  22.23,22.86 0 top
R74  5.71,22.86 0 top
R75  11.81,12.06 0 top
R76  28.32,12.06 180 top
R77  104.01,12.83 90 top
R78  73.41,13.97 90 top
R79  100.33,9.65 90 top
R80  28.57,21.59 180 top
R81  12.06,21.59 180 top
R82  41.91,16.51 0 top
R83  94.11,31.75 90 top
R84  47.75,17.78 270 top
R85  98.3,12.83 90 top
R86  35.81,6.35 90 top
R87  48.26,22.86 180 top
R88  50.16,27.81 270 top
R89  85.34,33.15 180 top
R90  62.23,33.02 270 top
RV1  11.2,-0.5 0 top
RV2  31.7,-0.5 0 top
RV3  52.2,-0.5 0 top
RV4  72.7,-0.5 0 top
RV5  56.13,27.81 90 top
RV6  79.63,37.47 90 top
SV1  13.97,36.83 180 top
SW1  89.1,3.51 0 top
SW2  96.2,3.51 0 top
SW3  102.3,3.51 0 top
TP1  58.42,35.56 180 top
TP2  87.25,30.73 0 top
TP3  70.61,21.08 0 top
TP4  83.82,29.21 0 top
U$2  [TREASURE_10MM_300DPI]  38.31,26.72 0 top
X1  57,39 180 top

### Tracks (layer width: path | path; a pad name or v marks a point on that pad's centre or on a via)
!NET_GATE
  Top 0.203: R15.1 78.14,7.2 78.99,6.35 80.77,6.35 81.28,6.86 IC12.4
!NET_GATE_F  (via drill 0.3)
  Top 0.203: IC14.6 56.6,8.34 56.9,8.64 58.42,8.64 59.82,7.24 v59.82,6.73 | C29.1 74.89,4.83 65.79,4.83 65.41,4.45 v61.21,4.45
  Top 0.305: R15.2 C29.1
  Bottom 0.203: v61.21,4.45 59.82,5.84 v59.82,6.73
+10V
  Top 0.305: R38.2 67.48,31.16 IC3.1 68.24,31.16 68.24,33.02 | R57.1 37.85,27.01 40.09,27.01 44.83,31.75 59.82,31.75 61.09,33.02 63.37,33.02 63.75,33.4 63.75,34.42 64.14,34.8 67.18,34.8 68.24,33.74 68.24,33.02 | R71.2 68.24,33.02
+12V  (via drill 0.3, 0.6)
  Top 0.203: IC12.12 IC12.13 IC12.14 | IC15.11 70.83,13.63 70.58,13.88 69.85,13.88 69.53,13.55 IC15.13 69.53,11.23 69.47,11.18 | IC15.3 68.88,8.34 v68.83,8.38 | v67.82,11.63 67.75,11.63
  Top 0.305: IC7.8 90.21,37.48 C10.1 88.41,37.48 87.76,36.83 87.76,34.14 R89.1 | C12.1 99.1,37.48 IC8.8 99.36,34.59 98.37,33.6 98.37,30.23 D6.A 98.3,28.27 v98.3,26.67 | v97.79,38.35 97.79,38.57 R12.2 | IC9.13 IC9.12 85.34,22.23 85.74,21.83 C4.1 92.69,21.83 92.98,22.11 C7.1 93.11,22.86 IC5.4 v96.77,22.86 | C11.1 IC1.4 v10.16,17.78 10.16,18.8 12.06,20.7 12.06,24.38 11.68,24.77 10.54,24.77 10.16,25.15 10.16,26.29 9.78,26.67 Q11.5 Q11.4 | Q10.4 Q10.5 25.15,26.67 25.4,26.42 25.4,25.4 26.04,24.77 28.19,24.77 28.57,24.38 | IC3.4 67.07,29.21 C15.1 66.69,28.97 66.29,28.57 64.52,28.57 v64.14,28.19 | C22.1 67.26,13.35 IC15.16 67.58,11.8 67.75,11.63 68.2,11.18 69.47,11.18 72.01,11.18 72.47,10.72 78.66,10.72 79.5,11.56 79.5,12.19 79.33,12.36 IC12.14 79.02,13.35 C17.1 | IC13.14 46.01,13.21 C19.1 44.7,13.19 v44.7,12.32 45.47,11.56 50.29,11.56 50.8,12.06 50.8,13.21 51.07,13.48 C18.1 53.04,13.48 IC14.16 53.35,11.93 v53.47,11.81 | v19.43,18.41 21.84,18.41 22.24,18.02 C20.1 22.62,17.78 IC2.4 25.43,17.78 28.57,20.92 28.57,24.38 | 28.57,24.38 29.21,25.02 29.21,27.43 29.72,27.94 v33.02,27.94 | 34.13,33.17 C23.+ 34.13,32.87 33.02,31.75 3.81,31.75 1.27,29.21 R60.1 | v35.81,23.97 36.2,23.59 36.2,22.1 37.34,20.95 38.23,20.95 38.75,20.43 C5.1 39.13,20.32 IC4.4 42.16,20.32 42.42,20.07 v42.42,17.65 | v53.47,9.33 56.01,9.33 | 56.01,9.33 61.59,9.33 62.09,9.84 v62.48,9.84 | 56.01,9.33 55.95,9.27 IC14.5 | IC6.11 59.31,24.77 60.07,25.53 C2.1 61.83,25.93 62.45,26.54 | R10.2 56.52,33.66 | 62.45,26.54 v62.48,26.54 | 62.45,26.54 59.94,29.06 58.83,29.06 58.04,29.84 v57.15,29.84 51.35,29.84 R88.1
  Top 0.61: C10.1 88.9,38.06 89.56,38.72 | C12.1 v97.79,38.35 | 89.56,38.72 89.92,39.08 R13.2 94.53,39.08 v95.25,38.35 | R10.2 56.09,38.63 X1.6 | v33.02,34.29 34.13,33.17 | v34.04,25.78 33.02,26.8 v33.02,27.94 | v88.9,39.37 89.56,38.72 | 56.52,33.66 v57.15,33.02
  Top 1.016: D1.C C23.+ 34.13,34.13 34.92,34.92 38.35,34.92 40.13,36.7 40.13,38.48 v40.39,38.73
  Bottom 0.305: v68.83,8.38 67.82,9.4 67.82,9.84 | 67.82,9.84 v67.82,11.63 | v53.47,9.33 v53.47,11.81 | v19.43,18.41 19.3,18.54 13.84,18.54 13.08,17.78 v10.16,17.78 | 34.04,25.75 v34.04,25.78 | v42.42,17.65 44.7,15.37 v44.7,12.32 | v62.48,9.84 67.82,9.84 | v96.77,22.86 96.77,25.15 v98.3,26.67 | v64.14,28.19 v62.48,26.54
  Bottom 0.61: v95.25,38.35 v97.79,38.35 | v33.02,27.94 v33.02,34.29 | v35.81,23.97 34.04,25.75 | v57.15,33.02 v57.15,29.84
  Bottom 1.016: v40.39,38.73 42.29,40.64 54.74,40.64 | X1.6 55.73,39.65 54.74,40.64 | 54.74,40.64 87.63,40.64 v88.9,39.37
-10V  (via drill 0.3)
  Top 0.305: R77.1 103.15,11.98 SW3.2 | v34.04,13.72 31.75,13.72 30.1,12.06 R76.1 29.97,12.06 v30.35,11.68 | R8.1 33.62,7.75 28.83,7.75 v28.7,7.62 | RV1.1 6.2,3.58 5.46,4.32 5.46,11.81 6.11,12.46 10.57,12.46 R75.1 | R37.1 64.81,33.19 63.22,31.6 R90.2 61.75,31.11 45.59,31.11 40.89,26.42 39.12,26.42 38.1,25.4 35.94,25.4 34.92,24.38 34.92,23.62 35.56,22.99 R56.1 34.42,16.85 v34.42,15.49
  Top 0.406: IC10.6 28.72,5.57
  Top 0.61: RV2.1 26.7,3.55 28.72,5.57 28.57,5.72 28.57,7.49 v28.7,7.62
  Bottom 0.305: 26.67,1.27 26.7,1.3 | 67.7,1.28 67.69,1.27 | 47.2,1.31 47.24,1.27 | v34.42,15.49 34.42,14.1 v34.04,13.72
  Bottom 0.61: RV1.1 8.23,1.27 26.67,1.27 47.24,1.27 67.69,1.27 96.52,1.27 99.06,3.81 99.06,7.89 SW3.2 | 26.7,1.3 RV2.1 | RV4.1 67.7,1.28 | RV3.1 47.2,1.31 | v30.35,11.68 30.35,9.27 v28.7,7.62
-12V  (via drill 0.3)
  Top 0.203: IC6.1 52.96,18.41 53.34,18.8 58.93,18.8 59.31,18.41
  Top 0.305: IC5.11 101.71,22.86 102.62,23.76 C8.2 v102.74,24.64 | C9.2 101.56,31.1 IC8.4 | IC1.11 14.21,17.78 C14.2 14.73,18.02 v14.73,17.14 | IC9.4 76.22,23.5 | 76.22,23.5 C3.2 75.68,23.51 75.18,24 75.18,25.78 75.95,26.54 75.95,27.94 75.55,28.34 C16.2 75.3,29.21 IC3.11 72.39,29.21 71.88,29.72 71.88,34.29 70.23,35.94 | IC6.6 59.31,18.41 59.69,18.8 62.88,18.8 C1.2 63.99,18.67 67.33,18.67 68.27,19.61 72.14,19.61 72.9,20.37 72.9,22.35 74.04,23.5 76.22,23.5 | v102.87,26.54 C9.2 | C9.2 102.89,31.11 v103.76,31.11 | 60.94,36.96 60.81,37.08 | v47.62,19.81 47.62,20.69 C6.2 47.23,20.32 IC4.11 44.32,20.32 44.07,20.07 44.07,18.57 45.09,17.56 45.09,15.62 44.96,15.49 v40.39,15.49 | v50.8,17.27 52.93,17.27 IC6.1 | v31.11,17.11 31.11,18.02 C21.2 30.85,17.78 IC2.11 v27.56,17.78 | C13.2 92.42,29.36 IC7.4 92.87,30.9 R83.1 94.19,30.99 v95.12,30.99
  Top 0.61: R90.1 60.81,35.86 60.81,37.08 X1.8 | v67.06,36.96 69.22,36.96 70.23,35.94 70.99,36.7 v71.88,36.7 | v63.88,36.96 60.94,36.96 | v75.44,38.73 77.34,40.64 95.25,40.64 96.14,39.75 v96.14,32.13
  Top 1.016: D2.A C24.- 34.13,39.22 35.56,40.64 59.69,40.64 60.81,39.52 X1.8
  Bottom 0.305: v102.74,24.64 102.87,24.77 v102.87,26.54 | v47.62,19.81 50.16,17.27 v50.8,17.27 | v14.73,17.14 15.36,16.52 26.29,16.52 v27.56,17.78 | v40.39,15.49 38.77,17.11 v31.11,17.11
  Bottom 0.61: v103.76,31.11 103.63,30.99 96.14,30.99 | 96.14,30.99 v95.12,30.99 | v67.06,36.96 v63.88,36.96 | v71.88,36.7 73.41,36.7 v75.44,38.73 | v96.14,32.13 96.14,30.99
ATT/!REL  (via drill 0.3)
  Top 0.203: IC13.10 48.66,13.96 | 48.66,13.96 48.51,14.1 47.62,14.1 | 47.62,14.1 47.36,13.83 IC13.12 | IC9.1 79.38,27.3 81.28,25.4 81.28,20.32 79.98,19.02 77.13,19.02 76.97,19.18 68.45,19.18 63.25,13.97 58.45,13.97 57.82,14.61 49.31,14.61 48.66,13.96 | v37.97,11.81 38.22,11.56 40.01,11.56 42.55,14.1 45.72,14.1 46.35,14.73 46.99,14.73 47.62,14.1 | Q1.1 16.66,9.53 18.16,9.53 19.18,10.54 23.9,10.54 24.59,9.86 37.36,9.86 37.87,10.36 v37.87,10.42
  Top 0.305: Q1.1 8.88,9.21 D9.C
  Bottom 0.203: v37.87,10.42 37.97,10.52 v37.97,11.81
ATT_CV_IN
  Top 0.305: X1.1 41.91,37.88 R48.1
ATT_SHP  (via drill 0.3)
  Top 0.305: v70.99,25.27 70.36,25.91 70.36,31.37 69.98,31.75 69.98,34.42 68.83,35.56 66.8,35.56 63.36,39 X1.9 | v73.91,22.35 76.58,19.68 IC9.7
  Bottom 0.305: v73.91,22.35 v70.99,25.27
ATT_V
  Top 0.305: R54.2 6.52,15.83 IC1.7 7.26,14.67 R19.1
DEC_CV_IN
  Top 0.305: X1.3 45.72,36.61 R35.1
DEC_V
  Top 0.305: R52.2 23.03,15.83 IC2.7 24.04,15.56 R18.1
ENV
  Top 0.305: IC5.9 101.55,21.56 102.49,20.62 D3.A 103.66,21.41 103.66,24.87 103.25,25.27 102.23,25.27 101.85,24.89 101.85,23.88 101.49,23.51 IC5.12 98.31,23.51 95.57,26.25 92.84,26.25 C34.2 R69.2 90.72,26.29 88.77,26.29 C25.2 88.27,26.04 IC9.15
ENV_ACTIVE  (via drill 0.3)
  Top 0.203: D7.C 7.11,8.89 7.87,8.13 17.65,8.13 19.56,10.03 23.11,10.03 23.67,9.47 41.22,9.47 42.04,10.29 49.78,10.29 50.55,11.05 54.38,11.05 55.15,11.81 v55.37,11.81 | IC9.16 83.06,27.3 81.92,26.16 81.92,19.43 82.3,19.05 85.6,19.05 85.98,18.67 85.98,18.03 85.75,17.8 77.08,17.8 76.47,18.41 68.96,18.41 63.37,12.83 58.93,12.83 57.91,11.81 v57.53,11.81 57.28,12.06 57.28,13.14 IC14.10
  Top 0.305: TP4.TP 84.35,28.68 IC9.16
  Bottom 0.203: v57.53,11.81 57.43,11.91 55.48,11.91 v55.37,11.81
ENV_OUT
  Top 0.305: IC5.13 IC5.14 100.18,25.32 98.51,25.32 95.69,28.13 92.01,28.13 | X1.11 69.69,40.26 72.01,40.26 72.9,39.37 72.9,38.44 78.44,32.89 79.46,32.89 80.22,32.13 R2.1 83.82,31.75 87.44,28.13 92.01,28.13 | IC7.3 91.77,28.38 92.01,28.13
ENV_OUT_INV
  Top 0.305: IC3.14 74.76,31.16 R1.2 75.35,34.62 X1.12
EXP_REF  (via drill 0.3)
  Top 0.305: IC3.7 66.78,25.82 R31.2 65.37,25.82 60.71,30.48 46.35,30.48 v44.83,28.96 | R51.1 3.17,27.3 4.83,28.96 v17.14,28.96 | R50.1 19.68,27.05 v19.94,27.3 21.59,28.96 v39.24,28.96
  Bottom 0.305: v44.83,28.96 v39.24,28.96
  Bottom 0.61: v17.14,28.96 18.29,28.96 v19.94,27.3
EXPO_OUT
  Top 0.305: IC4.14 46.82,22.27 R87.2 47.16,23.11 C30.2 46.9,25.02 R9.1
GATE
  Top 0.305: C35.1 79.84,14.35 82.08,14.35 R25.1 82.33,14.26 81.93,13.86 IC12.10
GATE_IN
  Top 0.305: X1.5 53.19,36.26 R41.1 R27.1
GATE_SW
  Top 0.305: SW1.1 84.33,10.82 84.33,14.31 R25.2
GND  (via drill 0.3)
  Top 0.203: IC15.4 69.53,6.8 v70.1,6.22
  Top 0.305: IC1.3 8.49,18.43 v8.51,18.41 | IC1.5 8.49,17.13 v8.51,17.14 | IC1.10 11.83,17.13 v11.81,17.14 | IC1.12 13.04,18.41 v11.81,18.41 | IC2.3 25,18.43 v25.02,18.41 | IC2.5 23.79,17.14 v25.02,17.14 | IC2.12 29.55,18.41 v28.32,18.41 | IC2.10 28.34,17.13 v28.32,17.14 | R68.1 12.91,24.47 v12.95,24.51 | R67.1 v30.35,23.5 | Q9.2 v25.4,22.86 | Q7.2 v8.89,22.86 | IC10.1 31.95,5.59 30.99,5.59 v30.86,5.71 | IC4.3 41.51,20.97 v41.53,20.95 | IC4.5 41.51,19.67 v41.53,19.68 | IC4.12 46.06,20.95 v44.83,20.95 | IC4.10 44.85,19.67 v44.83,19.68 | Q8.2 v43.31,25.15 | IC3.3 69.45,29.86 v69.47,29.84 | IC3.5 69.45,28.56 v69.47,28.57 | IC3.10 72.79,28.56 v72.77,28.57 | IC9.5 v79.76,22.23 | IC9.11 v82.8,20.95 | IC12.7 83.9,7.29 v83.95,7.24 | IC15.8 72.82,7.29 v72.9,7.37 | IC14.8 58.63,7.41 v58.67,7.37 | IC14.3 IC14.4 55.3,8.45 v55.24,8.51 | IC14.15 IC14.14 54.65,12.23 v54.48,12.06 | IC13.7 50.63,7.41 v50.67,7.37 | IC5.3 94.91,23.5 v96.01,23.5 | C21.1 32.77,18.4 v32.77,18.92 | IC8.1 99.31,31.39 v99.31,32.89 | IC7.1 90.42,31.39 v90.42,32.89 | C13.1 94.5,29.84 v94.74,29.84 | C14.1 15.89,18.68 v16.38,19.18
  other vias: 3.56,17.78 20.07,17.4 36.83,7.37 48.9,19.81 36.58,19.94 49.02,32.77 54.74,35.18 77.72,28.96 64.52,29.59 73.03,35.43 87.12,37.72 87,35.05 88.9,35.31 97.79,35.31 102.87,33.27 103.76,38.35 103.76,28.19 89.15,30.23 76.2,21.34 92.96,17.14 92.96,9.65 78.74,11.94 66.93,12.06 52.7,12.19 42.55,13.21 74.55,7.24 64.52,17.4 62.36,11.68 63.12,24.64 76.2,14.86 38.61,33.02 38.61,38.1 45.85,17.53 86.49,24 90.81,22.73 102.74,21.59
  pour Top (isolate 0.305): 0,0 105,0 105,41.5 0,41.5
  pour Bottom (isolate 0.305): 0,0 105,0 105,41.5 0,41.5
H_CV_IN
  Top 0.305: X1.2 43.81,37.24 R40.1
H_TIMER_Q
  Top 0.203: IC15.6 70.83,8.68 70.1,9.4 66.55,9.4 64.65,7.5 61.66,7.5 60.26,6.1 46.35,6.1 44.95,7.5 41.37,7.5 39.77,9.09 26.53,9.09 R61.1
  Top 0.305: IC15.6 70.83,6.43 R34.1
H_TIMER_RC  (via drill 0.3)
  Top 0.203: IC15.2 68.2,7.31 68.2,8.13 67.94,8.38 67.18,8.38 63.89,5.09 61.53,5.09 61.28,5.33 42.88,5.33 42.51,4.96 41.47,4.96 40.77,5.66 40.77,6.86 39.29,8.33 28.3,8.33 26.48,6.51 26.48,5.77 26.07,5.36 24.15,5.36 22.26,7.24 21.21,7.24 20.19,8.26 v20.19,8.89 | R30.1 17.36,21.84 17.78,21.42 17.78,13.97 18.41,13.34 19.9,13.34 20.45,12.79 v20.45,11.94
  Top 0.305: IC15.2 68.22,6.71 68.8,6.13 C37.2
  Bottom 0.203: v20.45,11.94 20.45,9.14 v20.19,8.89
H_V
  Top 0.305: R53.2 13.8,15.83 IC1.8 12.66,15.43 R17.1
I_ABC
  Top 0.305: IC6.16 52.96,22.44 52.2,21.68 R65.2
INT_IN  (via drill 0.3)
  Top 0.305: IC5.7 96.1,19.7 R5.2 96.1,17.87 v95.23,17 | R85.1 97.05,11.98 SW2.2
  Bottom 0.305: v95.23,17 94.85,16.62 94.85,12.48 SW2.2
LT_0V  (via drill 0.3)
  Top 0.203: IC12.2 IC12.1 79.33,9.19 78.61,9.91 71.18,9.91 v71.12,9.85 | IC15.12 70.17,12.5 70.74,11.94 v71.12,11.94 | v94.87,28.83 94.87,28.96 95.83,29.91 95.83,31.3 95.12,32 95.12,34.76 R42.2 | v91.06,15.24 89.85,15.24 88.95,16.13 81.21,16.13 81.08,16.26 76.38,16.26 76.21,16.44 72.01,16.44 v71.81,16.63
  Top 0.305: R13.1 R42.2 91.48,35.77 91.11,36.14 IC7.7
  Bottom 0.203: v71.12,9.85 v71.12,11.94 71.75,12.57 71.75,16.58 v71.81,16.63 | v94.87,28.83 94.87,28.35 91.69,25.18 91.69,15.88 v91.06,15.24
LT_VREF  (via drill 0.3)
  Top 0.203: D8.C 7.92,7.62 17.78,7.62 19.81,9.65 21.97,9.65 24.51,7.11 26.29,7.11 27.89,8.71 39.62,8.71 41.21,7.12 44.79,7.12 46.19,5.71 60.54,5.71 61.94,7.12 65.16,7.12 67.06,9.02 69.85,9.02 70.17,8.69 v70.17,8.38 IC15.5 | IC12.5 81.93,8.37 | v80.64,9.65 81.93,8.37 | v78.23,9.2 77.98,9.45 72.09,9.45 v71.83,9.2 | 81.93,8.37 82.04,8.26 85.09,8.26 85.98,7.36 87.02,7.36 87.79,8.13 87.79,9.17 87.05,9.9 86.11,9.9 85.33,10.68 85.33,14.25 85.98,14.9 87.46,14.9 89.92,12.44 92.09,12.44 92.87,13.21 92.87,14.12 92.08,14.92 v92.08,15.24 | v95.89,28.83 95.89,29.18 96.85,30.15 96.85,39.33 97.85,40.33 99.59,40.33 100.29,39.62 R12.1
  Top 0.305: IC8.7 100,39.08 R12.1 C31.1
  Bottom 0.203: v80.64,9.65 80.19,9.2 v78.23,9.2 | v71.83,9.2 70.99,9.2 v70.17,8.38 | v92.08,15.24 92.08,25.02 v95.89,28.83
MULT_OUT  (via drill 0.3)
  Top 0.203: v70.87,17.78 71.12,18.03 76.31,18.03 76.92,17.42 87.87,17.42 R4.1
  Top 0.305: R4.1 R3.1 | IC4.8 47.52,16.93 R84.2 49.39,16.93 C26.2 50.67,18.21 51.23,18.21 52.45,19.43 67.31,19.43 68.07,20.19 69.72,20.19 TP3.TP
  Bottom 0.305: TP3.TP 70.61,18.03 v70.87,17.78
N$1
  Top 1.016: D2.C SV1.1
  Bottom 1.016: SV1.1 SV1.2
N$2
  Top 0.305: IC3.13 76.36,30.51 77.05,31.2 R1.1 R2.2
N$3
  Top 0.203: R34.2 73.88,6.35 78.11,6.35 80.14,4.32 87.25,4.32 89.03,6.1 89.03,11.2 SW1.3
N$4
  Top 0.305: R69.1 C34.1 92.84,24.81 IC5.1
N$5
  Top 0.305: IC5.8 100.71,20.89 100.71,19.63 D3.C 104.39,19 104.39,25.02 103.5,25.91 102.11,25.91 99.57,28.45 99.57,29.84 100,30.28 IC8.2
N$6  (via drill 0.3)
  Top 0.203: D5.A 76.45,11.48 v76.45,12.7 | C36.2 R21.2 93.51,15.88 90.04,15.88 89.28,16.64 76.58,16.64 76.2,17.02 v75.95,17.02
  Bottom 0.203: v75.95,17.02 76.83,16.13 76.83,13.08 v76.45,12.7
N$8
  Top 0.305: R51.2 3.17,21.38 C32.1 4.23,19.65 4.8,19.08 IC1.2 7.29,19.05 8.38,19.05 8.89,19.56 8.89,21.21 Q7.6
N$9
  Top 0.305: C30.1 48.86,23.11 R87.1 49.11,22.19 48.54,21.62 IC4.13 45.05,21.62 44.7,21.97 44.7,22.73 45.09,23.11 45.09,25.65 44.84,25.9 Q8.3
N$10
  Top 0.305: IC6.12 58.04,21.72 57.15,20.83 50.39,20.83 49.79,20.23 49.79,19.04 C26.1 47.77,18.64 R84.1 47.36,19.02 IC4.9
N$11
  Top 0.305: IC15.1 67.58,6.65 67.09,6.17 C37.1
N$12
  Top 0.305: IC6.15 54.23,24.64 51.9,26.96 R88.2
N$13
  Top 0.305: IC5.6 94.2,21.56 92.8,20.15 | 92.8,20.15 R3.2 | R5.1 94.03,18.92 92.8,20.15
N$14
  Top 0.305: IC6.13 56.77,25.91 RV5.1 57.4,29.08 52.96,29.08 51.69,27.81 49.4,27.81 48.6,27.01 R9.2
N$15
  Top 1.016: SV1.10 12.7,33.02 D1.A
  Bottom 1.016: SV1.9 SV1.10
N$16
  Top 0.305: IC6.7 IC6.8
N$17
  Top 0.305: IC12.6 82.58,6.21 R26.2
N$18  (via drill 0.3)
  Top 0.203: IC12.3 80.63,8.52 78.87,10.29 71.77,10.29 71.39,10.67 66.23,10.67 65.06,11.84 65.06,12.29 v64.77,12.57 | v46.74,14.1 46.71,14.07 IC13.13 | v48.01,14.73 48.26,14.99 59.05,14.99 59.44,14.61 v62.74,14.61
  Bottom 0.203: v48.01,14.73 47.37,14.73 v46.74,14.1 | v62.74,14.61 v64.77,12.57
N$19
  Top 0.305: IC1.1 6.52,19.73 C32.2 5.93,20.74 4.87,21.8 R74.1
N$20
  Top 0.305: R64.1 85.09,39.37 85.09,36.45 85.08,36.43 IC11.3 84.24,36.43 R63.2
N$21
  Top 0.305: RV6.2 80.34,39.62 83.22,39.62 R64.2
N$22
  Top 0.305: IC15.15 68.22,13.82 67.73,14.31 C38.1
N$23
  Top 0.305: IC8.3 100.66,29.36 D6.C R16.2
N$24
  Top 0.305: Q7.4 Q7.5 R74.2
N$25
  Top 0.305: R22.2 13.8,19.73 IC1.14 12.91,19.88 R81.1
N$26  (via drill 0.3)
  Top 0.305: RV2.2 30.05,1.65 24.26,1.65 18.99,6.91 v17.14,6.91 | R39.1 17.14,12.28 v17.14,12.19
  Bottom 0.305: v17.14,12.19 v17.14,6.91
N$27
  Top 0.305: LED4.A 63.27,9.31 R59.2
N$28
  Top 0.305: IC10.3 32.02,6.93 32.73,6.93 R8.2 R86.1
N$29
  Top 0.305: Q7.1 10.31,21.59 R81.2 R68.2
N$30
  Top 0.305: Q6.3 15.05,26.48 15.24,26.3 15.66,25.88 R30.2
N$31
  Top 0.305: SW3.1 100.54,8.59 R79.1
N$32
  Top 0.305: IC1.9 15.24,16.48 | R39.2 14.39,13.5 16.09,15.2 R53.1 16.09,15.63 15.24,16.48 | R40.2 39.59,30.48 20.07,30.48 16.51,26.92 16.51,21.72 17.08,21.14 17.08,16.95 16.61,16.48 15.24,16.48
N$33
  Top 0.305: Q1.3 9.82,10.16 8.64,11.34 R19.2
N$34
  Top 0.305: C27.2 39.33,17.65 R20.2 39.29,18.37 IC4.7 40.28,17.29 R82.1
N$35
  Top 0.305: Q11.6 8.74,25.4 R29.2 7.2,27.27 8.13,28.19 12.2,28.19 Q6.1
N$36
  Top 0.305: Q11.3 Q11.2 Q11.1 12.97,25.92 Q6.2
N$37
  Top 0.305: SW3.3 102.3,15.26 R43.1
N$38
  Top 0.305: D4.A 73.79,11.85 R11.2 75.27,13.34 75.82,13.34 77.09,14.61 C35.2
N$39  (via drill 0.3)
  Top 0.203: IC12.8 IC12.9 82.58,12.1 v82.42,11.94 | v80.9,15.62 80.64,15.88 76.23,15.88 76.05,16.05 69.29,16.05 v68.45,16.89
  Top 0.305: Q3.3 R10.1 54.4,33.23 55.24,32.38 59.18,32.38 v59.31,32.51 | v59.31,29.84 60.33,29.84 65.53,24.64 v65.53,20.95
  Bottom 0.305: v59.31,32.51 v59.31,29.84 | v82.42,11.94 82.42,14.1 v80.9,15.62 | v68.45,16.89 68.45,17.02 65.53,19.94 v65.53,20.95
N$40
  Top 0.305: R27.2 49.95,34.86 Q3.1
N$41
  Top 0.305: R6.2 81.66,30.65 77.98,30.65 77.19,29.86 IC3.12 72.9,29.86 72.9,32.68 R7.1
N$42
  Top 0.305: Q7.3 9.02,24.38 6.22,24.38 5.5,25.11 R29.1
N$43
  Top 0.305: R28.2 91.11,29.43 IC7.2 91.11,32.31 91.57,32.77 94.11,32.77 | R83.2 94.11,32.77 | 94.11,32.77 R42.1
N$44  (via drill 0.3)
  Top 0.203: 100.33,16.51 100.2,16.51 99.44,17.27 96.52,17.27 95.5,16.26 90.3,16.26 89.53,17.02 76.77,17.02 76.19,17.6 71.7,17.6 71.25,17.14 69.4,17.14 v69.34,17.2 | v66.67,20.95 66.67,23.5 69.47,26.29 69.47,27.56 69.12,27.91 IC3.6
  Top 0.305: R77.2 104.01,15.37 102.87,16.51 100.33,16.51 100.33,15.53 R43.2 100.33,15.46 R79.2 | IC3.6 66.43,27.91 R31.1
  Bottom 0.203: v66.67,20.95 66.67,19.87 v69.34,17.2
N$45  (via drill 0.3)
  Top 0.305: IC9.14 86.74,24.77 C25.1 89,23.71 93.56,23.71 94.01,24.16 IC5.2 94.92,24.13 96.65,24.13 98,22.77 98,18.41 v98.26,18.16 | v98.26,16.51 R36.2 98.26,13.72 R85.2 98.42,13.68 99.51,12.59 99.51,11.49 98.52,10.5 R70.2
  Bottom 0.305: v98.26,16.51 v98.26,18.16
N$46
  Top 0.305: Q4.1 72.28,23.73 71.75,24.26 71.75,26.29 72.73,27.26 IC3.8
N$47  (via drill 0.3)
  Top 0.203: RV4.2 70.26,0.86 63.78,0.86 59.69,4.95 43.17,4.95 42.79,4.58 41.14,4.58 39.37,6.35 v39.37,7.24
  Top 0.305: v39.5,12.19 39.46,12.23 R44.1
  Bottom 0.305: v39.5,12.19 39.5,7.37 v39.37,7.24
N$48
  Top 0.305: IC9.10 87,19.68 87.46,20.15 R4.2 88.9,20.32 89.82,21.24 93.06,21.24 94.03,22.21 IC5.5
N$49
  Top 0.305: R47.1 4.7,13.25 4.7,5.71 3.17,4.19 3.17,1.78 3.68,1.27 10.16,1.27 11.2,2.31 RV1.2
N$50
  Top 0.305: R18.2 25.74,11.64 26.46,10.92 33.06,10.92 Q2.3
N$51
  Top 0.305: IC2.9 31.91,16.48 | 31.91,16.48 32.6,15.79 R55.1 33.36,14.48 37.25,14.48 R44.2 | R45.2 45.47,32.55 44.32,32.55 39.46,27.69 36.96,27.69 33.66,24.38 33.66,17.65 32.48,16.48 31.91,16.48
N$52
  Top 0.305: R22.1 16.09,19.9 15.27,19.08 IC1.13 11.46,19.08 10.96,18.58 R17.2 10.96,13.77 R75.2
N$53  (via drill 0.3)
  Top 0.305: IC4.6 37.69,19.02 37.25,18.58 R20.1 37.63,17.65 C27.1 37.59,16.3 36.58,16.3 | Q1.2 24.45,11.11 25.27,10.29 34.67,10.29 34.92,10.54 34.92,11.81 35.75,12.63 Q2.2 36.07,12.63 36.07,13.59 v35.94,13.72 | R56.2 36.58,16.3 | v36.58,15.49 36.58,16.3
  Bottom 0.305: v36.58,15.49 36.58,14.35 v35.94,13.72
N$54
  Top 0.305: Q8.1 43.18,23.37 43.18,16.93 R82.2 R66.2
N$55
  Top 0.305: IC6.14 55.5,25.91 RV5.3
N$56
  Top 0.305: IC1.6 4.92,16.48 | 4.92,16.48 4.23,15.79 R54.1 3.21,14.22 R47.2 | R48.2 38.31,31.11 5.71,31.11 1.91,27.3 1.91,17.78 3.21,16.48 4.92,16.48
N$57  (via drill 0.3)
  Top 0.305: RV3.2 49.79,0.89 22.73,0.89 18.41,5.21 v18.41,6.1 | v18.16,11.87 18.3,11.87 18.92,12.48 R49.1
  Bottom 0.305: v18.41,6.1 18.16,6.35 v18.16,11.87
N$58
  Top 0.305: IC2.6 21.31,16.48 | 21.31,16.48 20.74,15.91 R52.1 19.47,13.97 19.47,14.06 19.3,14.06 R49.2 | R35.2 44.32,33.31 43.69,33.31 40.22,29.84 20.95,29.84 18.67,27.56 18.67,17.4 19.59,16.48 21.31,16.48
N$59
  Top 0.305: SW2.3 96.56,14.03 R36.1
N$60
  Top 0.305: R57.2 37.08,23.88 37.25,23.71 C28.1 37.25,22.31 37.94,21.62 IC4.2 40.31,21.59 41.91,21.59 42.41,22.09 Q8.6
N$61
  Top 0.305: IC4.1 39.54,22.27 C28.2 39.16,23.07 R72.1
N$62
  Top 0.305: Q4.2 74.32,25.03 R58.2 74.33,25.82 75.31,26.8 75.31,27.56 74.96,27.91 IC3.9 72.38,27.91 71.08,29.21 71.08,32.77 R71.1
N$63
  Top 0.305: SW2.1 96.41,8.8 R70.1
N$64
  Top 0.305: Q8.4 Q8.5 41.24,25.15 R72.2
N$65
  Top 0.305: R24.1 32.6,19.9 31.78,19.08 IC2.13 27.72,19.08 26.84,18.2 26.84,14.61 R23.2 R76.2
N$66
  Top 0.305: R50.2 19.68,21.38 C33.1 20.74,19.9 21.56,19.08 IC2.2 24.8,19.08 25.4,19.68 25.4,21.21 Q9.6
N$67
  Top 0.305: R26.1 87,5.71 88.39,7.11 88.39,10.16 87.42,11.13 SW1.2
N$69
  Top 0.305: IC3.2 66.01,30.51 65.19,31.33 R38.1 66.4,32.96 R37.2
N$70
  Top 0.305: IC2.1 23.03,19.73 C33.2 22.44,20.74 21.38,21.8 R73.1
N$71
  Top 0.305: R73.2 Q9.5 Q9.4
N$72
  Top 0.305: R80.1 29.43,19.88 IC2.14 30.31,19.73 R24.2
N$73
  Top 0.203: IC13.3 47.36,6.87 47.75,6.48 56.9,6.48 57.25,6.83 IC14.7
N$75
  Top 0.203: R61.2 24.41,6.26 22.14,8.54 LED2.A
N$76
  Top 0.305: R67.2 R80.2 26.82,21.59 Q9.1
N$77  (via drill 0.3)
  Top 0.203: IC13.5 48.66,8.37 | v48.01,12.19 IC13.11 | IC14.11 56.6,11.39 v56.66,11.34 | v55.37,10.96 54.95,10.54 50.83,10.54 48.66,8.37 | v48.01,9.27 48.66,8.62 48.66,8.37
  Bottom 0.203: v48.01,9.27 v48.01,12.19 | v56.66,11.34 56.29,10.96 v55.37,10.96
N$78
  Top 0.305: R62.2 43.57,9.56 42.76,9.56 42,8.79 LED3.A
N$79
  Top 0.305: R65.1 51.18,20.11 66.97,20.11 68.82,21.96 68.82,23.88 69.33,24.38 Q4.3
N$80
  Top 0.305: R58.1 76.29,24.77 IC9.3 80.14,24.77 80.52,24.38 80.52,21.46 80.01,20.95 IC9.6
N$81
  Top 0.305: R33.2 32.8,23.98 Q5.3
N$82
  Top 0.305: Q10.6 23.98,25.4 R32.2 22.44,27.14 23.5,28.19 27.44,28.19 Q5.1
N$83
  Top 0.305: IC6.10 IC6.9
N$84
  Top 0.305: Q10.3 Q10.2 Q10.1 28.21,25.92 Q5.2
N$85
  Top 0.305: Q9.3 25.53,24.38 21.76,24.38 R32.1
N$86
  Top 0.203: IC13.1 IC13.2 46.71,8.22 46.99,8.51 47.75,8.51 48.01,8.26 IC13.4
N$88
  Top 0.305: LED1.A 1.27,8.81 | 1.27,8.81 R60.2 | D9.A D7.A | D8.A D7.A | D7.A 3.42,8.81 1.27,8.81
REL/!ATT  (via drill 0.3)
  Top 0.203: IC9.8 77.06,18.41 76.68,18.8 68.71,18.8 63.2,13.29 58.03,13.29 IC14.9 57.9,13.85 57.53,14.22 50.38,14.22 49.96,13.8 IC13.8 IC13.9 49.28,13.13 v49.28,12.19 | R62.1 43.75,11.14 43.89,11 49.2,11 v49.28,10.92
  Top 0.305: IC9.9 IC9.8 | Q2.1 36.34,11.05 43.6,11.05 R62.1
  Bottom 0.203: v49.28,10.92 v49.28,12.19
REL_SHP  (via drill 0.3)
  Top 0.305: X1.10 67.78,40.89 72.77,40.89 73.72,39.94 73.72,39.02 79.21,33.53 v80.01,33.53 | v80.01,29.72 78.36,28.07 76.96,28.07 76.58,27.69 76.58,26.54 77.09,26.04 IC9.2
  Bottom 0.305: v80.01,29.72 v80.01,33.53
RETRIG
  Top 0.203: R78.2 73.41,15.3 73.78,15.67 75.77,15.67 75.95,15.49 80.21,15.49 80.66,15.04 81.27,15.04 81.72,15.49 88.04,15.49 89.86,13.67 SW1.6
RETRIG_SW
  Top 0.305: SW1.5 92.53,12.02 C36.1 R46.1
TRIGS
  Top 0.203: IC13.6 49.31,8.16 51.18,10.03 55.37,10.03 55.95,10.61 55.95,10.67 | 55.95,10.67 IC14.12 | D5.C D4.C 71.5,8.59 69.93,10.16 63.5,10.16 63.12,10.16 62.61,10.67 59.13,10.67 | R14.2 59.6,11.14 59.13,10.67 | 55.95,10.67 59.13,10.67
VREF  (via drill 0.3)
  Top 0.305: IC11.1 83.33,37.73 82.06,36.47 RV6.1 81.43,35.64 R89.2 83.87,33.1 | R6.1 83.38,32.6 83.87,33.1 | TP2.TP 86.49,31.5 85.47,31.5 83.87,33.1 | IC5.10 99.46,22.21 v98.93,22.73 | v86.36,27.94 86.87,27.43 95.47,27.43 98.64,24.26 v98.93,24.26
  Bottom 0.305: v98.93,22.73 v98.93,24.26 | v86.36,27.94 86.36,29.84 TP2.TP
W_CV_IN
  Top 0.305: X1.4 48.06,36.41 R45.1
W_TIMER_!Q
  Top 0.305: IC15.9 73.32,13.04 R78.1
W_TIMER_Q
  Top 0.203: R59.1 64.14,12.83 66.93,15.62 70.74,15.62 71.47,14.88 IC15.10
W_TIMER_RC  (via drill 0.3)
  Top 0.203: R33.1 34.51,17.59 33.84,16.92 33.84,15.25 34.18,14.91 40.08,14.91 40.39,14.61 45.47,14.61 46.23,15.37 63.37,15.37 v63.5,15.24 | v68.83,12.01 68.88,12.05 IC15.14
  Top 0.305: IC15.14 68.88,13.76 69.43,14.31 C38.2
  Bottom 0.203: v63.5,15.24 65.6,15.24 v68.83,12.01
W_V
  Top 0.305: IC2.8 30.31,15.83 R55.2 30.44,15.24 R23.1

### Text on the board
tPlace: FULL-SCALE V | -12V | aloysius B v1.0 | (c) 2022 expert sleepers